# EAGLE design updateMate (EAGLE 9.7.0)
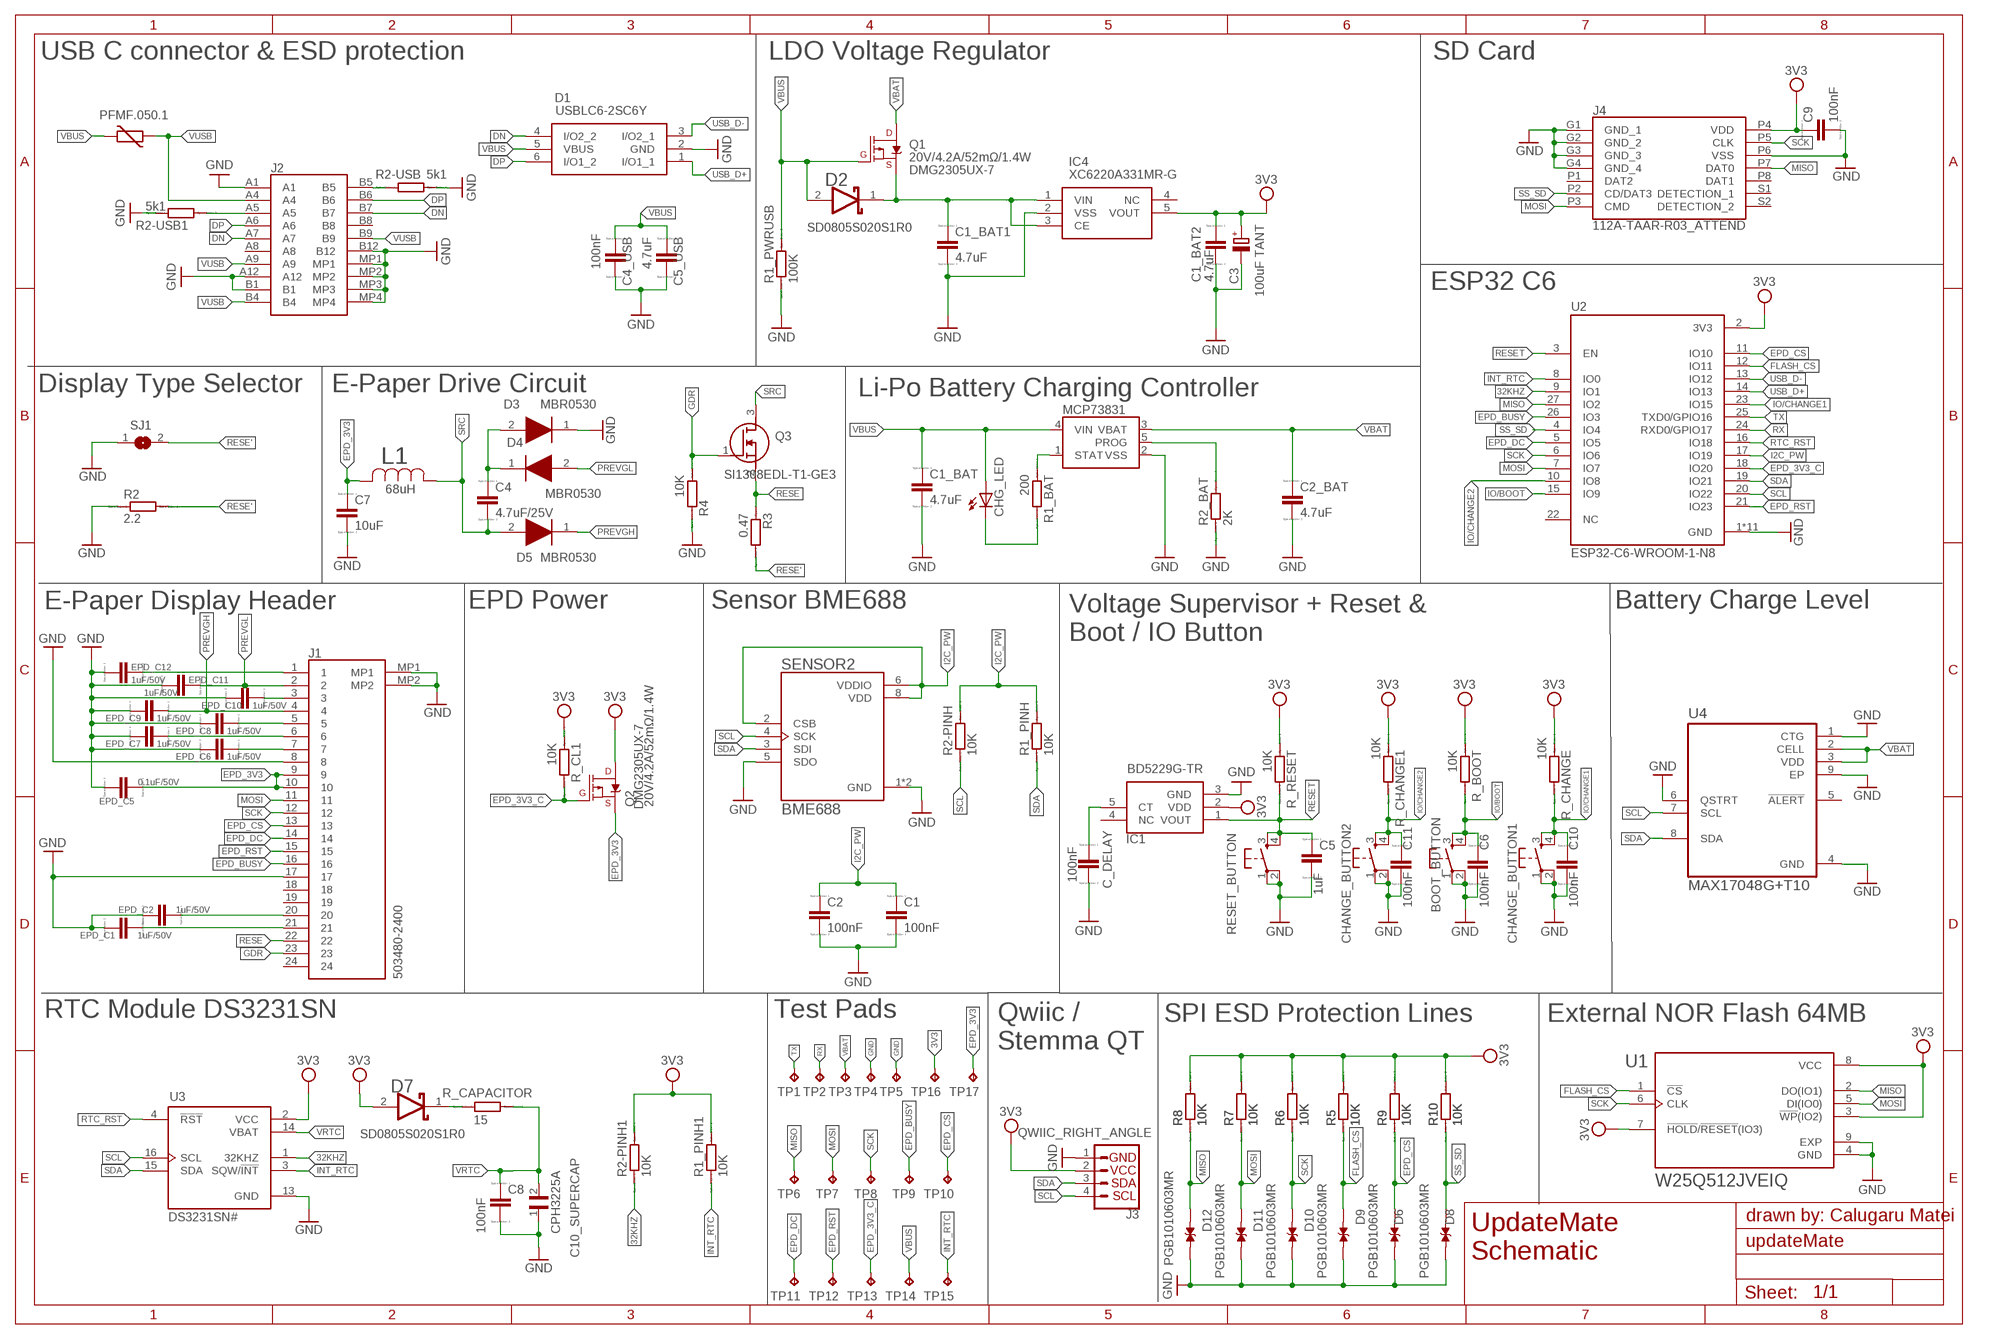
[diagram p0: schematic, sheet 1]

## Parts
BOOT_BUTTON  BUTTON_CUSYOMV1  [MYBUTTON]
C1  100nF  ESP32_WROVER_EAGLE-LTSPICE_CC0402  [ESP32_WROVER_EAGLE-LTSPICE_C0402]
C1_BAT  4.7uF  ESP32_WROVER_EAGLE-LTSPICE_CC0402  [ESP32_WROVER_EAGLE-LTSPICE_C0402]
C1_BAT1  4.7uF  ESP32_WROVER_EAGLE-LTSPICE_CC0402  [ESP32_WROVER_EAGLE-LTSPICE_C0402]
C1_BAT2  4.7uF  ESP32_WROVER_EAGLE-LTSPICE_CC0402  [ESP32_WROVER_EAGLE-LTSPICE_C0402]
C2  100nF  ESP32_WROVER_EAGLE-LTSPICE_CC0402  [ESP32_WROVER_EAGLE-LTSPICE_C0402]
C2_BAT  4.7uF  ESP32_WROVER_EAGLE-LTSPICE_CC0402  [ESP32_WROVER_EAGLE-LTSPICE_C0402]
C3  100uF TANT  RCL_CPOL-EUCT3528  [RCL_CT3528]
C4  4.7uF/25V  ESP32_WROVER_EAGLE-LTSPICE_CC0402  [ESP32_WROVER_EAGLE-LTSPICE_C0402]
C4_USB  100nF  ESP32_WROVER_EAGLE-LTSPICE_CC0402  [ESP32_WROVER_EAGLE-LTSPICE_C0402]
C5  1uF  ESP32_WROVER_EAGLE-LTSPICE_CC0402  [ESP32_WROVER_EAGLE-LTSPICE_C0402]
C5_USB  4.7uF  ESP32_WROVER_EAGLE-LTSPICE_CC0402  [ESP32_WROVER_EAGLE-LTSPICE_C0402]
C6  100nF  ESP32_WROVER_EAGLE-LTSPICE_CC0402  [ESP32_WROVER_EAGLE-LTSPICE_C0402]
C7  10uF  ESP32_WROVER_EAGLE-LTSPICE_CC0402  [ESP32_WROVER_EAGLE-LTSPICE_C0402]
C8  100nF  ESP32_WROVER_EAGLE-LTSPICE_CC0402  [ESP32_WROVER_EAGLE-LTSPICE_C0402]
C9  100nF  EAGLE-LTSPICE_CC0402  [EAGLE-LTSPICE_C0402]
C10  100nF  ESP32_WROVER_EAGLE-LTSPICE_CC0402  [ESP32_WROVER_EAGLE-LTSPICE_C0402]
C10_SUPERCAP  CPH3225A  [CAPCP3225X100N]
C11  100nF  ESP32_WROVER_EAGLE-LTSPICE_CC0402  [ESP32_WROVER_EAGLE-LTSPICE_C0402]
C_DELAY  100nF  ESP32_WROVER_EAGLE-LTSPICE_CC0402  [ESP32_WROVER_EAGLE-LTSPICE_C0402]
CHANGE_BUTTON1  BUTTON_CUSYOMV1  [MYBUTTON]
CHANGE_BUTTON2  BUTTON_CUSYOMV1  [MYBUTTON]
CHG_LED  ADAFRUIT_LEDCHIP-LED0603  [ADAFRUIT_CHIP-LED0603]
D1  USBLC6-2SC6Y  [SOT95P280X145-6N]
D2  ESP32_WROVER_AVX---SD0805S020S1R0_AVX_SD0805S020S1R0AVX_SD0805S020S1R0_0_0  ESP32_WROVER_AVX---SD0805S020S1R0_AVX_SD0805S020S1R0_0_0AVX_SD0805S020S1R0_0_0  [ESP32_WROVER_AVX---SD0805S020S1R0_AVX_SD0805S020S1R0_0]
D3  MBR0530  [SOD3716X135N]
D4  MBR0530  [SOD3716X135N]
D5  MBR0530  [SOD3716X135N]
D6  PGB1010603MR  [DIOC1608X36N]
D7  SD0805S020S1R0  ESP32_WROVER_AVX---SD0805S020S1R0_AVX_SD0805S020S1R0_0_0AVX_SD0805S020S1R0_0_0  [ESP32_WROVER_AVX---SD0805S020S1R0_AVX_SD0805S020S1R0_0]
D8  PGB1010603MR  [DIOC1608X36N]
D9  PGB1010603MR  [DIOC1608X36N]
D10  PGB1010603MR  [DIOC1608X36N]
D11  PGB1010603MR  [DIOC1608X36N]
D12  PGB1010603MR  [DIOC1608X36N]
EPD_C1  1uF/50V  ESP32_WROVER_EAGLE-LTSPICE_CC0402  [ESP32_WROVER_EAGLE-LTSPICE_C0402]
EPD_C2  1uF/50V  ESP32_WROVER_EAGLE-LTSPICE_CC0402  [ESP32_WROVER_EAGLE-LTSPICE_C0402]
EPD_C5  0.1uF/50V  ESP32_WROVER_EAGLE-LTSPICE_CC0402  [ESP32_WROVER_EAGLE-LTSPICE_C0402]
EPD_C6  1uF/50V  ESP32_WROVER_EAGLE-LTSPICE_CC0402  [ESP32_WROVER_EAGLE-LTSPICE_C0402]
EPD_C7  1uF/50V  ESP32_WROVER_EAGLE-LTSPICE_CC0402  [ESP32_WROVER_EAGLE-LTSPICE_C0402]
EPD_C8  1uF/50V  ESP32_WROVER_EAGLE-LTSPICE_CC0402  [ESP32_WROVER_EAGLE-LTSPICE_C0402]
EPD_C9  1uF/50V  ESP32_WROVER_EAGLE-LTSPICE_CC0402  [ESP32_WROVER_EAGLE-LTSPICE_C0402]
EPD_C10  1uF/50V  ESP32_WROVER_EAGLE-LTSPICE_CC0402  [ESP32_WROVER_EAGLE-LTSPICE_C0402]
EPD_C11  1uF/50V  ESP32_WROVER_EAGLE-LTSPICE_CC0402  [ESP32_WROVER_EAGLE-LTSPICE_C0402]
EPD_C12  1uF/50V  ESP32_WROVER_EAGLE-LTSPICE_CC0402  [ESP32_WROVER_EAGLE-LTSPICE_C0402]
IC1  BD5229G-TR  [SOT95P280X125-5N]
IC4  XC6220A331MR-G  [SOT95P280X120-5N]
J1  503480-2400  [5034802400]
J2  SAMACSYS_PARTS_USB4110-GF-A  [SAMACSYS_PARTS_USB4110GFA]
J3  QWIIC_RIGHT_ANGLE  QWIIC_CONNECTORJS-1MM  [JST04_1MM_RA]
J4  112A-TAAR-R03_ATTEND  [112ATAARR03ATTEND]
L1  68uH  744043680IND_4828-WE-TPC_WRE  [IND_4828-WE-TPC_WRE]
MCP73831  ESP32_WROVER_SPARKFUN-IC-POWER_MCP73831  [ESP32_WROVER_SPARKFUN-IC-POWER_SOT23-5]
PFMF.050.1  ESP32C6_VARISTORCN1812  [ESP32C6_VARISTOR_CT/CN1812]
Q1  20V/4.2A/52mΩ/1.4W  ESP32_WROVER_SPARKFUN-DISCRETESEMI_MOSFET_PCH-DMG2305UX-7  [ESP32_WROVER_SPARKFUN-DISCRETESEMI_SOT23-3]
Q2  20V/4.2A/52mΩ/1.4W  ESP32_WROVER_SPARKFUN-DISCRETESEMI_MOSFET_PCH-DMG2305UX-7  [ESP32_WROVER_SPARKFUN-DISCRETESEMI_SOT23-3]
Q3  SI1308EDL-T1-GE3  [SOT65P210X110-3N]
R1_BAT  200  ESP32_WROVER_EAGLE-LTSPICE_RR0402  [ESP32_WROVER_EAGLE-LTSPICE_R0402]
R1_PINH  10K  ESP32_WROVER_EAGLE-LTSPICE_RR0402  [ESP32_WROVER_EAGLE-LTSPICE_R0402]
R1_PINH1  10K  ESP32_WROVER_EAGLE-LTSPICE_RR0402  [ESP32_WROVER_EAGLE-LTSPICE_R0402]
R1_PWRUSB  100K  ESP32_WROVER_EAGLE-LTSPICE_RR0402  [ESP32_WROVER_EAGLE-LTSPICE_R0402]
R2  2.2  ESP32_WROVER_EAGLE-LTSPICE_RR0402  [ESP32_WROVER_EAGLE-LTSPICE_R0402]
R2-PINH  10K  ESP32_WROVER_EAGLE-LTSPICE_RR0402  [ESP32_WROVER_EAGLE-LTSPICE_R0402]
R2-PINH1  10K  ESP32_WROVER_EAGLE-LTSPICE_RR0402  [ESP32_WROVER_EAGLE-LTSPICE_R0402]
R2-USB  5k1  ESP32_WROVER_EAGLE-LTSPICE_RR0402  [ESP32_WROVER_EAGLE-LTSPICE_R0402]
R2-USB1  5k1  ESP32_WROVER_EAGLE-LTSPICE_RR0402  [ESP32_WROVER_EAGLE-LTSPICE_R0402]
R2_BAT  2K  ESP32_WROVER_EAGLE-LTSPICE_RR0402  [ESP32_WROVER_EAGLE-LTSPICE_R0402]
R3  0.47  ESP32_WROVER_EAGLE-LTSPICE_RR0402  [ESP32_WROVER_EAGLE-LTSPICE_R0402]
R4  10K  ESP32_WROVER_EAGLE-LTSPICE_RR0402  [ESP32_WROVER_EAGLE-LTSPICE_R0402]
R5  10K  ESP32_WROVER_EAGLE-LTSPICE_RR0402  [ESP32_WROVER_EAGLE-LTSPICE_R0402]
R6  10K  ESP32_WROVER_EAGLE-LTSPICE_RR0402  [ESP32_WROVER_EAGLE-LTSPICE_R0402]
R7  10K  ESP32_WROVER_EAGLE-LTSPICE_RR0402  [ESP32_WROVER_EAGLE-LTSPICE_R0402]
R8  10K  ESP32_WROVER_EAGLE-LTSPICE_RR0402  [ESP32_WROVER_EAGLE-LTSPICE_R0402]
R9  10K  ESP32_WROVER_EAGLE-LTSPICE_RR0402  [ESP32_WROVER_EAGLE-LTSPICE_R0402]
R10  10K  ESP32_WROVER_EAGLE-LTSPICE_RR0402  [ESP32_WROVER_EAGLE-LTSPICE_R0402]
R_BOOT  10K  ESP32_WROVER_EAGLE-LTSPICE_RR0402  [ESP32_WROVER_EAGLE-LTSPICE_R0402]
R_CAPACITOR  15  ESP32_WROVER_EAGLE-LTSPICE_RR0402  [ESP32_WROVER_EAGLE-LTSPICE_R0402]
R_CHANGE  10K  ESP32_WROVER_EAGLE-LTSPICE_RR0402  [ESP32_WROVER_EAGLE-LTSPICE_R0402]
R_CHANGE1  10K  ESP32_WROVER_EAGLE-LTSPICE_RR0402  [ESP32_WROVER_EAGLE-LTSPICE_R0402]
R_CL1  10K  ESP32_WROVER_EAGLE-LTSPICE_RR0402  [ESP32_WROVER_EAGLE-LTSPICE_R0402]
R_RESET  10K  ESP32_WROVER_EAGLE-LTSPICE_RR0402  [ESP32_WROVER_EAGLE-LTSPICE_R0402]
RESET_BUTTON  BUTTON_CUSYOMV1  [MYBUTTON]
SENSOR2  BME688  ESP32_WROVER_BME680_BME680  [ESP32_WROVER_BME680_PSON80P300X300X100-8N]
SJ1  SJ  [SJ]
TP1  TPTP20R  [TP20R]
TP2  TPTP20R  [TP20R]
TP3  TPTP20R  [TP20R]
TP4  TPTP20R  [TP20R]
TP5  TPTP20R  [TP20R]
TP6  TPTP20R  [TP20R]
TP7  TPTP20R  [TP20R]
TP8  TPTP20R  [TP20R]
TP9  TPTP20R  [TP20R]
TP10  TPTP20R  [TP20R]
TP11  TPTP20R  [TP20R]
TP12  TPTP20R  [TP20R]
TP13  TPTP20R  [TP20R]
TP14  TPTP20R  [TP20R]
TP15  TPTP20R  [TP20R]
TP16  TPTP20R  [TP20R]
TP17  TPTP20R  [TP20R]
U1  W25Q512JVEIQ  [SON127P600X800X80-9N]
U2  ESP32-C6-WROOM-1-N8  [XCVR_ESP32-C6-WROOM-1-N8]
U3  DS3231SN#  [SOIC127P1032X265-16N]
U4  MAX17048G+T10  [SON50P200X200X80-9N]

## Nets
3V3 [HIGH_CURRENT]: C1_BAT2.1 C3.+ C9.1 D7.2(ANODE) IC1.2(VDD) IC4.5(VOUT) J3.2 J4.P4(VDD) Q2.3(D) R1_PINH1.2 R2-PINH1.2 R5.2 R6.2 R7.2 R8.2 R9.2 R10.2 R_BOOT.1 R_CHANGE1.1 R_CHANGE.1 R_CL1.1 R_RESET.1 TP16.TP U1.3(!WP!(IO2)) U1.7(!HOLD!/!RESET!(IO3)) U1.8(VCC) U2.2(3V3) U3.2(VCC)
32KHZ: R2-PINH1.1 U2.9(IO1) U3.1(32KHZ)
DN: D1.4(I/O2_2) J2.A7 J2.B7
DP: D1.6(I/O1_2) J2.A6 J2.B6
EPD_3V3: C7.1 EPD_C5.1 J1.9 J1.10 L1.2 Q2.2(S) TP17.TP
EPD_3V3_C [HIGH_CURRENT]: Q2.1(G) R_CL1.2 TP13.TP U2.18(IO20)
EPD_BUSY: J1.16 TP9.TP U2.26(IO3)
EPD_CS: D6.1 J1.13 R9.1 TP10.TP U2.11(IO10)
EPD_DC: J1.14 TP11.TP U2.5(IO5)
EPD_RST: J1.15 TP12.TP U2.21(IO23)
FLASH_CS: D9.1 R5.1 U1.1(!CS) U2.12(IO11)
GDR: J1.23 Q3.1(G) R4.1
GND: BOOT_BUTTON.1 BOOT_BUTTON.2 C1.2 C1_BAT1.2 C1_BAT2.2 C1_BAT.2 C2.2 C2_BAT.2 C3.- C4_USB.2 C5.2 C5_USB.2 C6.2 C7.2 C8.2 C9.2 C10.2 C10_SUPERCAP.1 C11.2 C_DELAY.2 CHANGE_BUTTON1.1 CHANGE_BUTTON1.2 CHANGE_BUTTON2.1 CHANGE_BUTTON2.2 D1.2(GND) D3.1(K) D6.2 D8.2 D9.2 D10.2 D11.2 D12.2 EPD_C1.2 EPD_C2.2 EPD_C5.2 EPD_C6.2 EPD_C7.2 EPD_C8.2 EPD_C9.2 EPD_C10.2 EPD_C11.2 EPD_C12.2 IC1.3(GND) IC4.2(VSS) J1.8 J1.17 J1.MP1 J1.MP2 J2.A1 J2.A12 J2.B1 J2.B12 J2.MP1 J2.MP2 J2.MP3 J2.MP4 J3.1 J4.G1(GND_1) J4.G2(GND_2) J4.G3(GND_3) J4.G4(GND_4) J4.P6(VSS) MCP73831.2(VSS) R1_PWRUSB.1 R2-USB1.1 R2-USB.2 R2.1 R2_BAT.1 R4.2 RESET_BUTTON.1 RESET_BUTTON.2 SENSOR2.1(GND) SENSOR2.5(SDO) SENSOR2.7(GND) SJ1.1 TP4.TP TP5.TP U1.4(GND) U1.9(EXP) U2.1(GND) U2.28(GND) U2.29_1(GND) U2.29_2(GND) U2.29_3(GND) U2.29_4(GND) U2.29_5(GND) U2.29_6(GND) U2.29_7(GND) U2.29_8(GND) U2.29_9(GND) U3.13(GND) U4.1(CTG) U4.4(GND) U4.6(QSTRT) U4.9(EP)
I2C_PW: C1.1 C2.1 R1_PINH.2 R2-PINH.2 SENSOR2.2(CSB) SENSOR2.6(VDDIO) SENSOR2.8(VDD) U2.17(IO19)
INT_RTC: R1_PINH1.1 TP15.TP U2.8(IO0) U3.3(SQW/!INT)
IO/BOOT: BOOT_BUTTON.3 BOOT_BUTTON.4 C6.1 R_BOOT.2 U2.15(IO9)
IO/CHANGE1: C10.1 CHANGE_BUTTON1.3 CHANGE_BUTTON1.4 R_CHANGE.2 U2.23(IO15)
IO/CHANGE2: C11.1 CHANGE_BUTTON2.3 CHANGE_BUTTON2.4 R_CHANGE1.2 U2.10(IO8)
MISO: D12.1 J4.P7(DAT0) R8.1 TP6.TP U1.2(DO(IO1)) U2.27(IO2)
MOSI: D11.1 J1.11 J4.P3(CMD) R7.1 TP7.TP U1.5(DI(IO0)) U2.7(IO7)
N$1: J2.B5 R2-USB.1
N$2: C_DELAY.1 IC1.5(CT)
N$3: C1_BAT1.1 D2.1(CATHODE) IC4.1(VIN) IC4.3(CE) Q1.2(S)
N$4: J2.A5 R2-USB1.2
N$7: D7.1(CATHODE) R_CAPACITOR.2
N$8: EPD_C1.1 J1.21
N$9: EPD_C2.1 J1.20
N$10: C4.1 D3.2(A) D4.1(K)
N$13: MCP73831.5(PROG) R2_BAT.2
N$14: MCP73831.1(STAT) R1_BAT.1
N$15: CHG_LED.C R1_BAT.2
N$31: EPD_C6.1 J1.7
N$33: EPD_C7.1 J1.6
N$34: EPD_C8.1 J1.5
N$36: EPD_C10.1 J1.3
N$37: EPD_C12.1 J1.1
PREVGH: D5.1(K) EPD_C9.1 J1.4
PREVGL: D4.2(A) EPD_C11.1 J1.2
RESE: J1.22 Q3.2(S) R3.1
RESE': R2.2 R3.2 SJ1.2
RESET: C5.1 IC1.1(VOUT) R_RESET.2 RESET_BUTTON.3 RESET_BUTTON.4 U2.3(EN)
RTC_RST: U2.16(IO18) U3.4(!RST)
RX: TP2.TP U2.24(RXD0/GPIO17)
SCK: D10.1 J1.12 J4.P5(CLK) R6.1 TP8.TP U1.6(CLK) U2.6(IO6)
SCL: J3.4 R2-PINH.1 SENSOR2.4(SCK) U2.20(IO22) U3.16(SCL) U4.7(SCL)
SDA: J3.3 R1_PINH.1 SENSOR2.3(SDI) U2.19(IO21) U3.15(SDA) U4.8(SDA)
SRC: C4.2 D5.2(A) L1.1 Q3.3(D)
SS_SD: D8.1 J4.P2(CD/DAT3) R10.1 U2.4(IO4)
TX: TP1.TP U2.25(TXD0/GPIO16)
USB_D+: D1.1(I/O1_1) U2.14(IO13)
USB_D-: D1.3(I/O2_1) U2.13(IO12)
VBAT [HIGH_CURRENT]: C2_BAT.1 MCP73831.3(VBAT) Q1.3(D) TP3.TP U4.2(CELL) U4.3(VDD)
VBUS [HIGH_CURRENT]: C1_BAT.1 C4_USB.1 C5_USB.1 CHG_LED.A D1.5(VBUS) D2.2(ANODE) MCP73831.4(VIN) PFMF.050.1.1 Q1.1(G) R1_PWRUSB.2 TP14.TP
VRTC: C8.1 C10_SUPERCAP.2 R_CAPACITOR.1 U3.14(VBAT)
VUSB [HIGH_CURRENT]: J2.A4 J2.A9 J2.B4 J2.B9 PFMF.050.1.2
Unconnected: IC1.4(NC) IC4.4(NC) J1.18 J1.19 J1.24 J2.A8 J2.B8 J4.P1(DAT2) J4.P8(DAT1) J4.S1(DETECTION_1) J4.S2(DETECTION_2) U2.22(NC) U4.5(!ALERT)

## Notes on the sheet
- USB C connector & ESD protection | LDO Voltage Regulator | SD Card
- DMG2305UX-7
- SD0805S020S1R0
- ESP32 C6
- Display Type Selector | E-Paper Drive Circuit | Li-Po Battery Charging Controller
- 68uH
- E-Paper Display Header | EPD Power | Sensor BME688 | Battery Charge Level
- Voltage Supervisor + Reset & 
  Boot / IO Button
- DMG2305UX-7
- RTC Module DS3231SN | Test Pads | SPI ESD Protection Lines | External NOR Flash 64MB
- Qwiic /
  Stemma QT
- SD0805S020S1R0
- drawn by: Calugaru Matei
- UpdateMate 
  Schematic

## Library data of the parts
BOOT_BUTTON CHANGE_BUTTON1 CHANGE_BUTTON2 RESET_BUTTON = ButtonLibrary:BUTTON_CUSYOMV1
C1 C1_BAT C1_BAT1 C1_BAT2 C2 C2_BAT C4 C4_USB C5 C5_USB C6-C8 C10 C11 C_DELAY EPD_C1 EPD_C2 EPD_C5-EPD_C12 = ESP32_C6_Library:ESP32_WROVER_EAGLE-LTSPICE_C: CAPACITOR, European symbol; SPICEMODEL: NONE; SPICEPREFIX: C
C3 = ESP32_C6_Library:RCL_CPOL-EU: POLARIZED CAPACITOR, European symbol; SPICEPREFIX: C
C9 = Hector_Watch:EAGLE-LTSPICE_C: CAPACITOR, European symbol; SPICEMODEL: NONE; SPICEPREFIX: C
C10_SUPERCAP = ESP32_C6_Library:CPH3225A: Cap 0.011F 3.3V 1210 Flat Check availability <https://pricing.snapeda.com/parts/CPH3225A/Seiko%20Instruments/view-part?ref=eda>; AVAILABILITY: Not in stock; CHECK_PRICES: https://www.snapeda.com/parts/CPH3225A/Seiko+Instruments/view-part/?ref=eda; DESCRIPTION: 11 mF (EDLC) Supercapacitor 3.3 V 1210 (3225 Metric) - -; MF: Seiko Instruments; MP: CPH3225A; PACKAGE: 1210 Seiko; PRICE: None; PURCHASE-URL: https://www.snapeda.com/api/url_track_click_mouser/?unipart_id=562593&manufacturer=Seiko Instruments&part_name=CPH3225A&search_term=None; SNAPEDA_LINK: https://www.snapeda.com/parts/CPH3225A/Seiko+Instruments/view-part/?ref=snap
CHG_LED = ESP32_C6_Library:ADAFRUIT_LED: LED OSRAM: - CHIPLED LG R971, LG N971, LY N971, LG Q971, LY Q971, LO R971, LY R971 LH N974, LH R974 LS Q976, LO Q976, LY Q976 LO Q996 - Hyper CHIPLED LW Q18S LB Q993, LB Q99A, LB R99A - SideLED LS A670, LO A670, LY A670, LG A670, LP A670 LB A673, LV A673, LT A673, LW A673 LH A674 LY A675 LS A676, LA A676, LO A676, LY A676, LW A676 LS A679, LY A679, LG A679 - Hyper Micro SIDELED® LS Y876, LA Y876, LO Y876, LY Y876 LT Y87S - SmartLED LW L88C, LW L88S LB L89C, LB L89S, LG L890 LS L89K, LO L89K, LY L89K LS L896, LA L896, LO L896, LY L896 - TOPLED LS T670, LO T670, LY T670, LG T670, LP T670 LSG T670, LSP T670, LSY T670, LOP T670, LYG T670 LG T671, LOG T671, LSG T671 LB T673, LV T673, LT T673, LW T673 LH T674 LS T676, LA T676, LO T676, LY T676, LB T676, LH T676, LSB T676, LW T676 LB T67C, LV T67C, LT T67C, LS T67K, LO T67K, LY T67K, LW E67C LS E67B, LA E67B, LO E67B, LY E67B, LB E67C, LV E67C, LT E67C LW T67C LS T679, LY T679, LG T679 LS T770, LO T770, LY T770, LG T770, LP T770 LB T773, LV T773, LT T773, LW T773 LH T774 LS E675, LA E675, LY E675, LS T675 LS T776, LA T776, LO T776, LY T776, LB T776 LHGB T686 LT T68C, LB T68C - Hyper Mini TOPLED® LB M676 - Mini TOPLED Santana® LG M470 LS M47K, LO M47K, LY M47K Source: http://www.osram.convergy.de/
D1 = ESP32_C6_Library:USBLC6-2SC6Y: Low Cap. ESD Protection Auto SOT-23-6 STMicroelectronics USBLC6-2SC6Y, Dual Uni-Directional TVS Diode Array, 6-Pin SOT-23 Source: Datasheet <https://componentsearchengine.com/Datasheets/1/USBLC6-2SC6Y.pdf> Check availability <https://pricing.snapeda.com/parts/USBLC6-2SC6Y/STMicroelectronics/view-part?ref=eda>; AVAILABILITY: In Stock; CHECK_PRICES: https://www.snapeda.com/parts/USBLC6-2SC6Y/STMicroelectronics/view-part/?ref=eda; DESCRIPTION: 17V Clamp 5A (8/20µs) Ipp Tvs Diode Surface Mount SOT-23-6; MF: STMicroelectronics; MP: USBLC6-2SC6Y; PACKAGE: SOT-23-6 STMicroelectronics; PRICE: None; SNAPEDA_LINK: https://www.snapeda.com/parts/USBLC6-2SC6Y/STMicroelectronics/view-part/?ref=snap
D2 D7 = ESP32_C6_Library:ESP32_WROVER_AVX---SD0805S020S1R0_AVX_SD0805S020S1R0_0_0: Schottky Barrier Rectifier Diode; CENTROID_NOT_SPECIFIED: No; DATASHEET: http://datasheets.avx.com/schottky.pdf; DIGIKEY_DESCRIPTION: DIODE SCHOTTKY 20V 1A 0805; DIGIKEY_PART_NUMBER: 478-7800-1-ND; LEAD_FREE: yes; MF: AVX; MOUSER_PART_NUMBER: 581-SD0805S020S1R0; PACKAGE: 0805 (2012 metric); PREFIX: D; ROHS: yes; TEMPERATURE_RANGE_HIGH: +125°C; TEMPERATURE_RANGE_LOW: -55°C
D3-D5 = ESP32_C6_Library:MBR0530: ON SEMICONDUCTOR - MBR0530 - DIODE, SCHOTTKY, 0.5A, 30V, SOD-123 Source: Datasheet <http://www.onsemi.com/pub/Collateral/MBR0530T1-D.PDF> Check availability <https://pricing.snapeda.com/parts/MBR0530/ON%20Semiconductor/view-part?ref=eda>; AVAILABILITY: In Stock; CHECK_PRICES: https://www.snapeda.com/parts/MBR0530/Onsemi/view-part/?ref=eda; DESCRIPTION: Diode Schottky 30 V 500mA Surface Mount SOD-123; MF: ON Semiconductor; MP: MBR0530; PACKAGE: SOD-123-2 ON Semiconductor; PRICE: None; PURCHASE-URL: https://www.snapeda.com/api/url_track_click_mouser/?unipart_id=179458&manufacturer=ON Semiconductor&part_name=MBR0530&search_term=None; SNAPEDA_LINK: https://www.snapeda.com/parts/MBR0530/Onsemi/view-part/?ref=snap
D6 D8-D12 = ESP32_C6_Library:PGB1010603MR: Check availability <https://pricing.snapeda.com/parts/PGB1010603MR/Littelfuse%20Inc./view-part?ref=eda>; AVAILABILITY: In Stock; CHECK_PRICES: https://www.snapeda.com/parts/PGB1010603MR/Littelfuse/view-part/?ref=eda; DESCRIPTION: 150V (Typ) Clamp - Ipp Tvs Diode Surface Mount 0603 (1608 Metric); MF: Littelfuse Inc.; MP: PGB1010603MR; PACKAGE: 0603 Littelfuse Inc.; PRICE: None; PURCHASE-URL: https://www.snapeda.com/api/url_track_click_mouser/?unipart_id=5659453&manufacturer=Littelfuse Inc.&part_name=PGB1010603MR&search_term=None; SNAPEDA_LINK: https://www.snapeda.com/parts/PGB1010603MR/Littelfuse/view-part/?ref=snap
IC1 = ESP32_C6_Library:BD5229G-TR: Voltage Detector with Adjustable Delay Time: CMOS processes are utilized to develop high precision, low current consumption CMOS reset ICs that allow arbitrary setting of the delay time. The extensive lineup includes both Nch Open Drain and CMOS output types in a wide range of detection voltages (from 2.3V to 6.0V, in 0.1V steps), enabling selection of the ideal solution based on customer requirements. In addition, the entire series is of course both lead-free and RoHS-compliant. Source: Datasheet <https://datasheet.datasheetarchive.com/originals/distributors/Datasheets_SAMA/f2b9741ef86007909f138d561a359946.pdf>; DESCRIPTION: Voltage Detector with Adjustable Delay Time: CMOS processes are utilized to develop high precision, low current consumption CMOS reset ICs that allow arbitrary setting of the delay time. The extensive lineup includes both Nch Open Drain and CMOS output types in a wide range of detection voltages (from 2.3V to 6.0V, in 0.1V steps), enabling selection of the ideal solution based on customer requirements. In addition, the entire series is of course both lead-free and RoHS-compliant.; HEIGHT: 1.25mm; MANUFACTURER_NAME: ROHM Semiconductor; MANUFACTURER_PART_NUMBER: BD5229G-TR; MOUSER_PART_NUMBER: 755-BD5229G-TR; MOUSER_PRICE-STOCK: https://www.mouser.co.uk/ProductDetail/ROHM-Semiconductor/BD5229G-TR?qs=4kLU8WoGk0vvnhrrYwdszw%3D%3D
IC4 = ESP32_C6_Library:XC6220A331MR-G: LDO Voltage Regulators Source: Datasheet <https://www.torexsemi.com/file/xc6220/XC6220.pdf>; DESCRIPTION: LDO Voltage Regulators; HEIGHT: 1.2mm; MANUFACTURER_NAME: Torex; MANUFACTURER_PART_NUMBER: XC6220A331MR-G; MOUSER_PART_NUMBER: 865-XC6220A331MR-G; MOUSER_PRICE-STOCK: https://www.mouser.co.uk/ProductDetail/Torex-Semiconductor/XC6220A331MR-G?qs=AsjdqWjXhJ8ZSWznL1J0gg%3D%3D
J1 = 503480-2400:503480-2400: FFC & FPC Connectors 0.5mm FPC RA SMT Dual Contact 24Ckt Source: Datasheet <https://componentsearchengine.com/Datasheets/1/503480-2400.pdf>; DESCRIPTION: FFC & FPC Connectors 0.5mm FPC RA SMT Dual Contact 24Ckt; HEIGHT: 1.87mm; MANUFACTURER_NAME: Molex; MANUFACTURER_PART_NUMBER: 503480-2400; MOUSER_PART_NUMBER: 538-503480-2400; MOUSER_PRICE-STOCK: https://www.mouser.co.uk/ProductDetail/Molex/503480-2400?qs=OAhjpuo3Vu7efIoxFh9AOw%3D%3D
J2 = ESP32_C6_Library:SAMACSYS_PARTS_USB4110-GF-A: CONN USB 2.0 TYPE-C R/A SMT Source: Datasheet <https://gct.co/files/drawings/usb4110.pdf>; DESCRIPTION: CONN USB 2.0 TYPE-C R/A SMT; HEIGHT: 3.26mm; MANUFACTURER_NAME: GCT (GLOBAL CONNECTOR TECHNOLOGY); MANUFACTURER_PART_NUMBER: USB4110-GF-A; MOUSER_PART_NUMBER: 640-USB4110-GF-A; MOUSER_PRICE-STOCK: https://www.mouser.co.uk/ProductDetail/GCT/USB4110-GF-A?qs=KUoIvG%2F9IlYiZvIXQjyJeA%3D%3D
J3 = ESP32_C6_Library:QWIIC_CONNECTOR: SparkFun I2C Standard Qwiic Connector An SMD 1mm pitch JST connector makes it easy and quick (get it? Qwiic?) to connect I2C devices to each other. The Qwiic system <http://www.sparkfun.com/qwiic> enables fast and solderless connection between popular platforms and various sensors and actuators. We carry 200mm <https://www.sparkfun.com/products/14204>, 100mm <https://www.sparkfun.com/products/14205>, 50mm <https://www.sparkfun.com/products/14206>, and breadboard friendly <https://www.sparkfun.com/products/14207> Qwiic cables. We also offer 10 pcs strips <https://www.sparkfun.com/products/14323> the SMD connectors.; PROD_ID: CONN-13694
J4 = Hector_Watch:112A-TAAR-R03_ATTEND: Micro SD Card Socket, Push-Push Type, Top Mount, SMT, H=1.83mm, 10u Source: Datasheet <https://www.attend.com.tw/data/download/file/112A-TAAR-R03.pdf>; DESCRIPTION: Micro SD Card Socket, Push-Push Type, Top Mount, SMT, H=1.83mm, 10u; HEIGHT: 1.9mm; MANUFACTURER_NAME: ATTEND; MANUFACTURER_PART_NUMBER: 112A-TAAR-R03 ATTEND
L1 = ESP32_C6_Library:744043680; COPYRIGHT: Copyright (C) 2024 Ultra Librarian. All rights reserved.; MANUFACTURER_PART_NUMBER: 744043680; MFR_NAME: Wurth Electronics
MCP73831 = ESP32_C6_Library:ESP32_WROVER_SPARKFUN-IC-POWER_MCP73831: MCP73831T Li-Ion, Li-Pol Controller Miniature single cell, fully integrated Li-Ion, Li-polymer charge management controller Datasheet <http://ww1.microchip.com/downloads/en/DeviceDoc/20001984g.pdf> SparkFun Products: SparkFun ESP32 Thing <https://www.sparkfun.com/products/13907> SparkFun 9DoF Razor IMU M0 <https://www.sparkfun.com/products/14001>; PROD_ID: IC-09995
PFMF.050.1 = ESP32_C6_Library:ESP32C6_VARISTOR: VARISTOR
Q1 Q2 = ESP32_C6_Library:ESP32_WROVER_SPARKFUN-DISCRETESEMI_MOSFET_PCH: P-channel MOSFETs Voltage controlled devices that allow control of high current outputs. SparkFun Products: SparkFun ESP32 Thing <https://www.sparkfun.com/products/13907> SparkFun ESP8266 Thing <https://www.sparkfun.com/products/13231> SparkFun Pi Servo HAT V2 <https://www.sparkfun.com/products/15316> DMG2305UX-7 (20V/4.2A/SOT23-3); PROD_ID: TRAN-14388
Q3 = ESP32_C6_Library:SI1308EDL-T1-GE3: MOSFET N-Ch 30V 1.5A TrenchFET SC70 Vishay Si1308EDL-T1-GE3 N-channel MOSFET Transistor, 1.5 A, 30 V, 3-Pin SC-70 Source: Datasheet <https://componentsearchengine.com/Datasheets/1/SI1308EDL-T1-GE3.pdf> Check availability <https://pricing.snapeda.com/parts/SI1308EDL-T1-GE3/Vishay%20Siliconix/view-part?ref=eda>; AVAILABILITY: In Stock; CHECK_PRICES: https://www.snapeda.com/parts/SI1308EDL-T1-GE3/Vishay+Siliconix/view-part/?ref=eda; DESCRIPTION: Si1308EDL-T1-GE3 N-channel MOSFET Transistor, 1.5 A, 30 V, 3-Pin SC-70 | Siliconix / Vishay SI1308EDL-T1-GE3; MF: Vishay Siliconix; MP: SI1308EDL-T1-GE3; PACKAGE: SOT-323 Vishay Semiconductor; PRICE: None; PURCHASE-URL: https://www.snapeda.com/api/url_track_click_mouser/?unipart_id=274603&manufacturer=Vishay Siliconix&part_name=SI1308EDL-T1-GE3&search_term=None; SNAPEDA_LINK: https://www.snapeda.com/parts/SI1308EDL-T1-GE3/Vishay+Siliconix/view-part/?ref=snap
R1_BAT R1_PINH R1_PINH1 R1_PWRUSB R2 R2-PINH R2-PINH1 R2-USB R2-USB1 R2_BAT R3-R10 R_BOOT R_CAPACITOR R_CHANGE R_CHANGE1 R_CL1 R_RESET = ESP32_C6_Library:ESP32_WROVER_EAGLE-LTSPICE_R: RESISTOR, European symbol; SPICEMODEL: NONE; SPICEPREFIX: R
SENSOR2 = ESP32_C6_Library:ESP32_WROVER_BME680_BME680: Integrated Environmental Unit; AVAILABILITY: Unavailable; DESCRIPTION: Integrated Environmental Unit; MF: Bosch Sensortec; MP: BME680; PACKAGE: LGA-8 Bosch Tools; PRICE: None
SJ1 = Hector_Watch:SJ: SMD solder JUMPER
TP1-TP17 = Hector_Watch:TP: Test pad
U1 = ESP32_C6_Library:W25Q512JVEIQ: Check availability <https://pricing.snapeda.com/parts/W25Q512JVEIQ/Winbond%20Electronics/view-part?ref=eda>; AVAILABILITY: In Stock; CHECK_PRICES: https://www.snapeda.com/parts/W25Q512JVEIQ/Winbond+Electronics/view-part/?ref=eda; DESCRIPTION: FLASH - NOR Memory IC 512Mb (64M x 8) SPI - Quad I/O 133 MHz 8-WSON (8x6); MF: Winbond Electronics; MP: W25Q512JVEIQ; PACKAGE: Package; PRICE: None; SNAPEDA_LINK: https://www.snapeda.com/parts/W25Q512JVEIQ/Winbond+Electronics/view-part/?ref=snap
U2 = ESP32_C6_Sparrow:ESP32-C6-WROOM-1-N8: Check availability <https://pricing.snapeda.com/parts/ESP32-C6-WROOM-1-N8/Espressif%20Systems/view-part?ref=eda>; AVAILABILITY: In Stock; CHECK_PRICES: https://www.snapeda.com/parts/ESP32-C6-WROOM-1-N8/Espressif+Systems/view-part/?ref=eda; DESCRIPTION: Multiprotocol Modules ESP32-C6 module, Wi-Fi 6 in 2.4 GHz band, Bluetooth 5, Zigbee 3.0 and Thread. ESP34-WROOM Compatible - ENGINEERING SAMPLE; MF: Espressif Systems; MP: ESP32-C6-WROOM-1-N8; PACKAGE: None; PRICE: None; SNAPEDA_LINK: https://www.snapeda.com/parts/ESP32-C6-WROOM-1-N8/Espressif+Systems/view-part/?ref=snap
U3 = ESP32_C6_Library:DS3231SN#: Real Time Clock Serial 16-Pin SOIC W T/R Check availability <https://pricing.snapeda.com/parts/DS3231SN%23/Analog%20Devices/view-part?ref=eda>; AVAILABILITY: In Stock; CHECK_PRICES: https://www.snapeda.com/parts/DS3231SN%23/Analog+Devices/view-part/?ref=eda; DESCRIPTION: Extremely Accurate I²C-Integrated RTC/TCXO/Crystal; MF: Analog Devices; MP: DS3231SN#; PACKAGE: SOIC-16 Maxim; PRICE: None; PURCHASE-URL: https://www.snapeda.com/api/url_track_click_mouser/?unipart_id=99048&manufacturer=Analog Devices&part_name=DS3231SN#&search_term=None; SNAPEDA_LINK: https://www.snapeda.com/parts/DS3231SN%23/Analog+Devices/view-part/?ref=snap
U4 = ESP32_C6_Library:MAX17048G+T10: Check availability <https://pricing.snapeda.com/parts/MAX17048G%2BT10/Analog%20Devices/view-part?ref=eda>; AVAILABILITY: In Stock; CHECK_PRICES: https://www.snapeda.com/parts/MAX17048G+T10/Analog+Devices/view-part/?ref=eda; DESCRIPTION: 3µA 1-Cell/2-Cell Fuel Gauge with ModelGauge; MF: Analog Devices; MP: MAX17048G+T10; PACKAGE: TDFN-8 Maxim; PRICE: None; PURCHASE-URL: https://www.snapeda.com/api/url_track_click_mouser/?unipart_id=329239&manufacturer=Analog Devices&part_name=MAX17048G+T10&search_term=None; SNAPEDA_LINK: https://www.snapeda.com/parts/MAX17048G+T10/Analog+Devices/view-part/?ref=snap

## Board
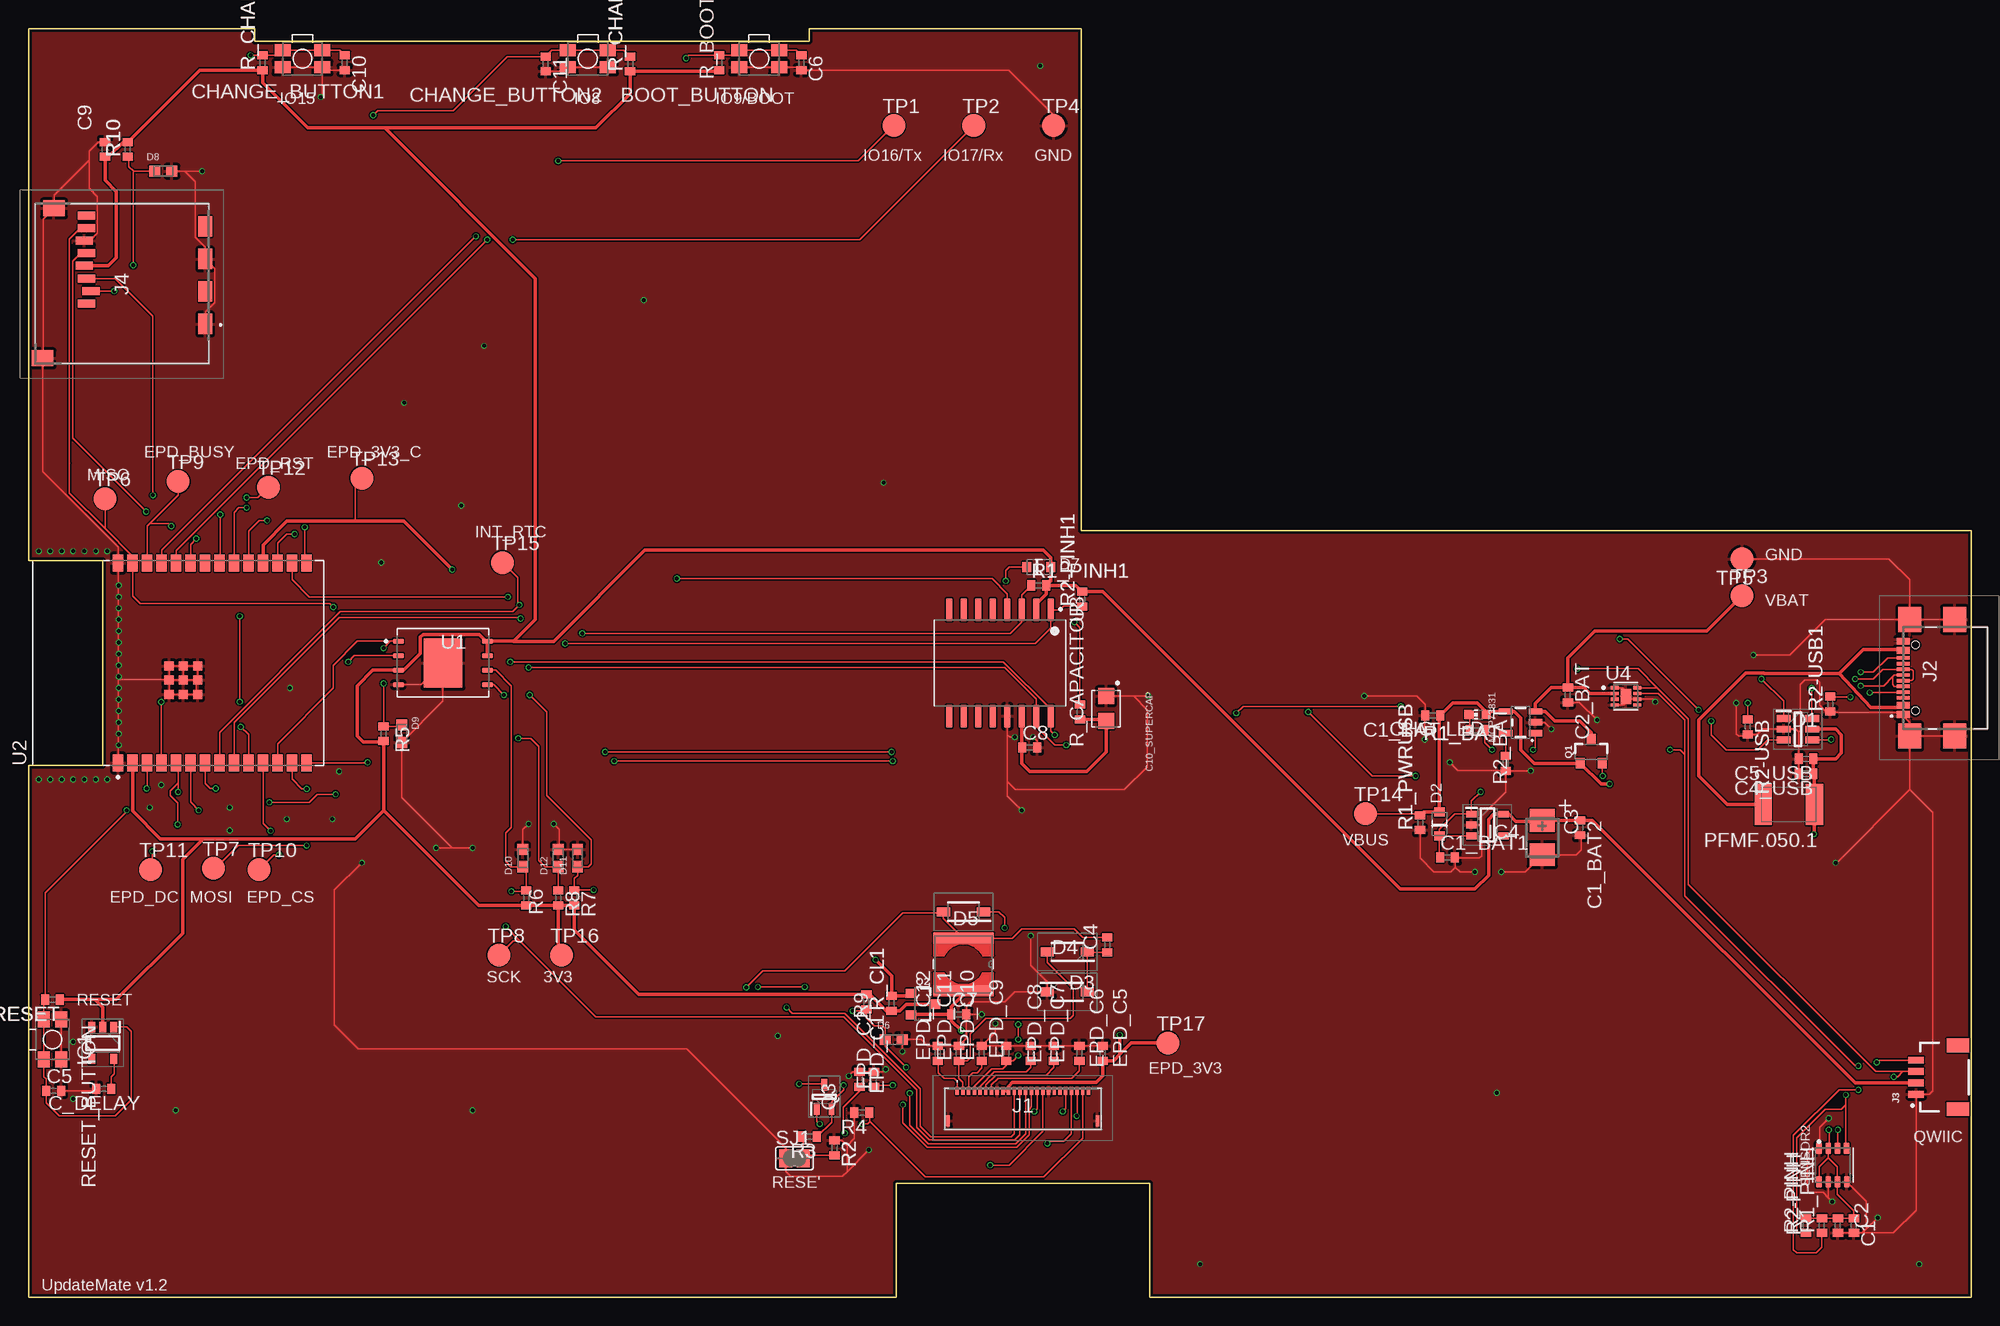
[diagram p1: board, top side]
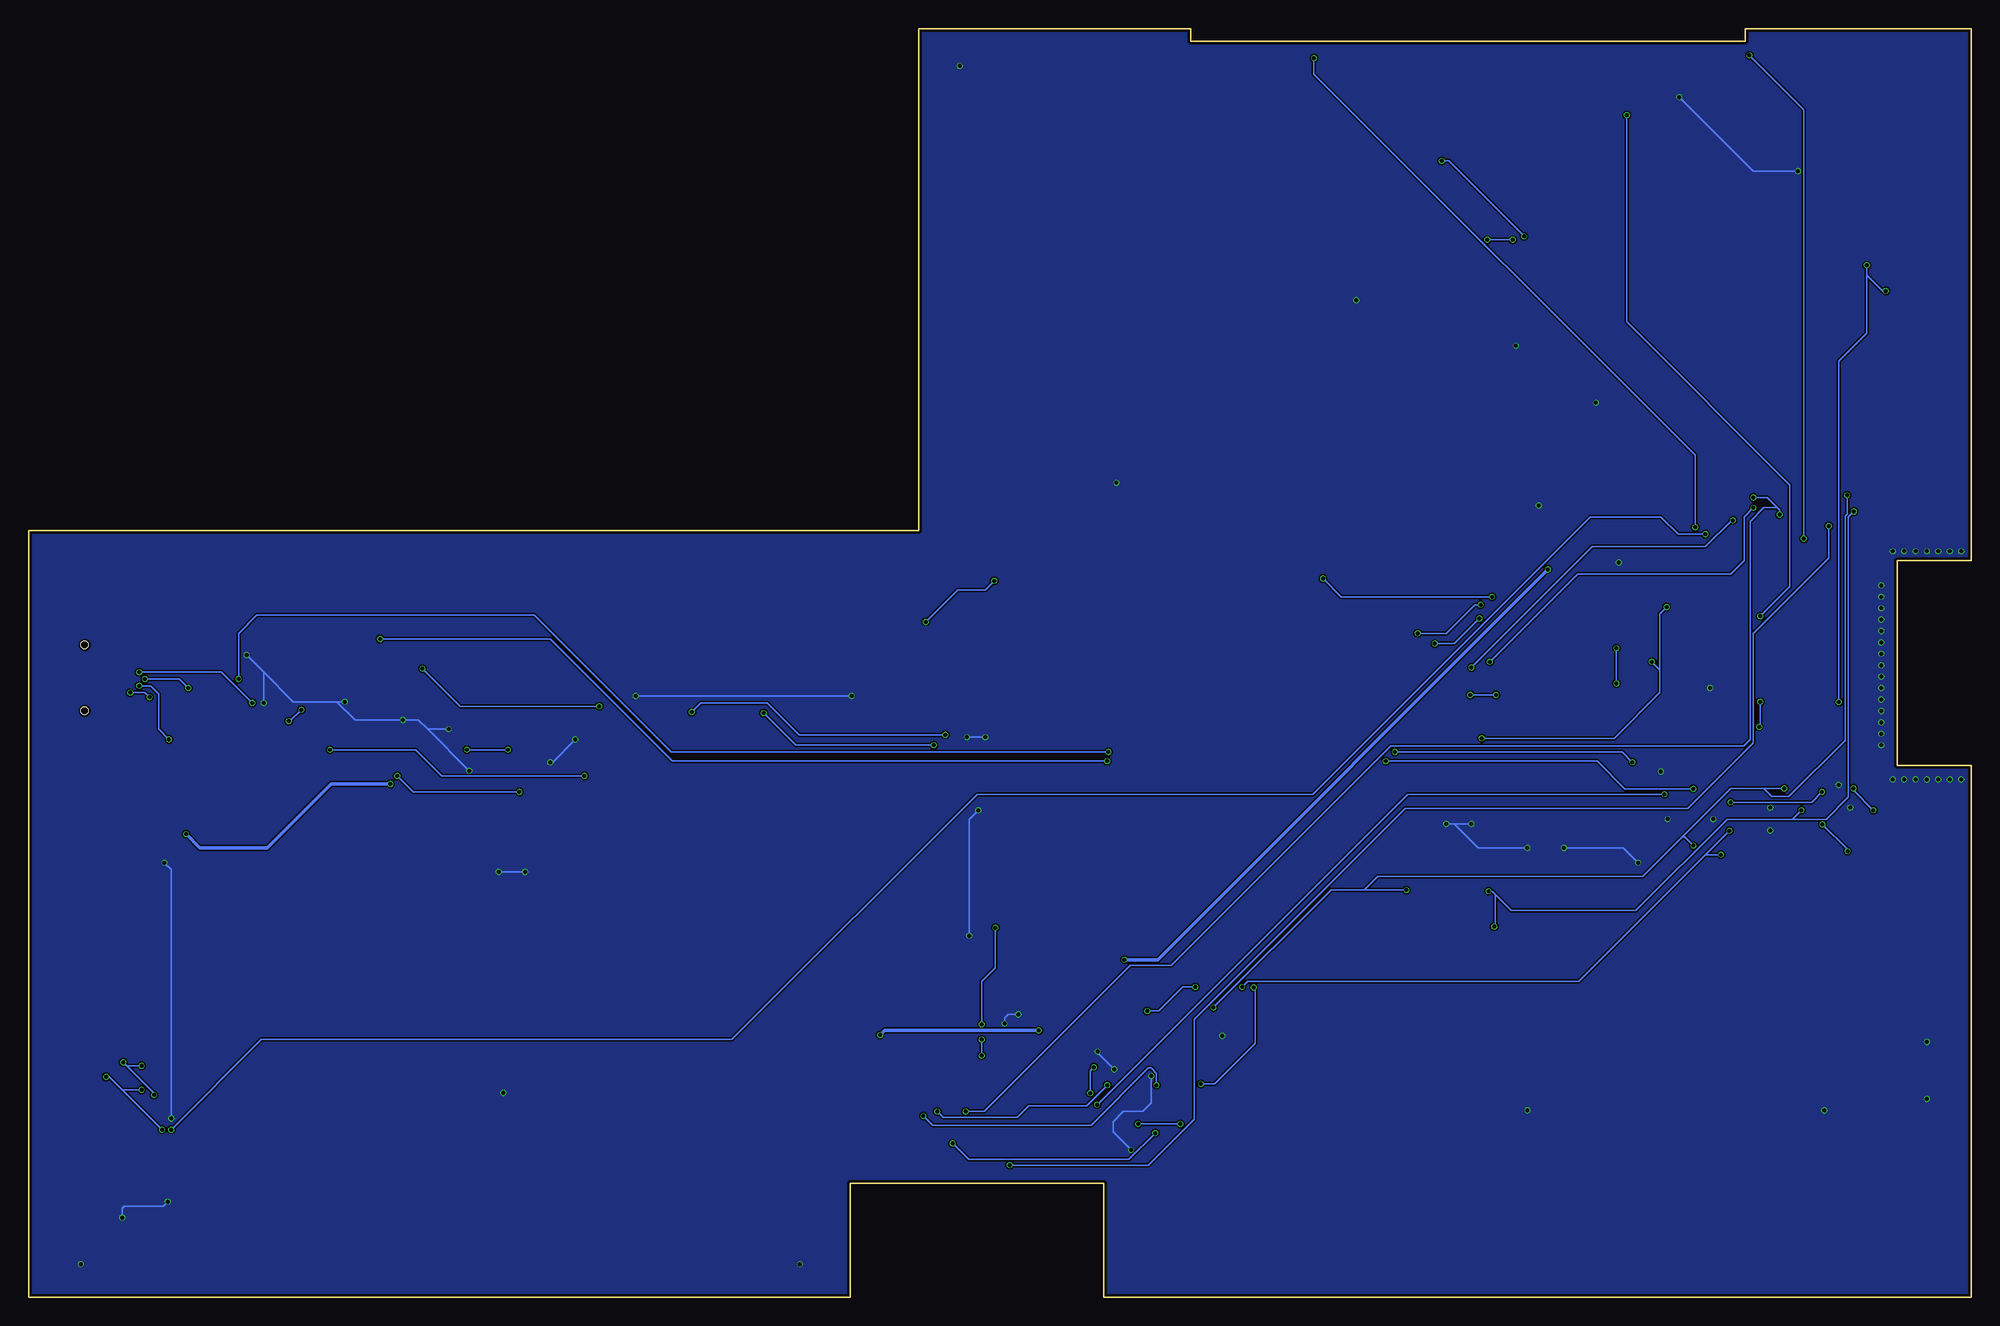
[diagram p2: board, bottom side, seen from below]

Size 170.2 x 111.2 mm. Coordinates in mm from the lower left corner, seen from the top.
Outline: 92.2,111.2 68.4,111.2 68.4,110.1 19.8,110.1 19.8,111.2 0,111.2 0,64.6 6.5,64.6 6.5,46.6 0,46.6 0,0 76,0 76,10 98.2,10 98.2,0 170.2,0 170.2,67.2 92.2,67.2 92.2,111.2
Copper layers (1*16): Top 0.035mm / dielectric 1.6mm / Bottom 0.035mm
Design rules "jlcpcb-2layers.dru *": minimum track width 5mil, minimum drill 0.3mm, track to track 5mil, track to pad 5mil, pad to pad 5mil, via to via 5mil, smd to smd 5mil, copper to edge 0.2mm, drill to drill 6mil, minimum pad ring 10mil, minimum via ring 3mil, stop-mask expansion 4mil, vias tented up to drill 1mm, thermal gap 10mil

### Footprints (pad centres in the part's own frame; a part is rotated, then mirrored left to right if it is on the bottom)
MYBUTTON = smd 1.4 x 1.05: 1 1.75,0.75; 2 -1.75,0.75; 3 -1.75,-0.75; 4 1.75,-0.75
ESP32_WROVER_EAGLE-LTSPICE_C0402 = smd 0.7 x 0.9: 1 -0.65,0; 2 0.65,0
RCL_CT3528 = smd 2 x 2.2: + -1.5,0; - 1.5,0
EAGLE-LTSPICE_C0402 = smd 0.7 x 0.9: 1 -0.65,0; 2 0.65,0
CAPCP3225X100N = smd 1.4 x 1.4: 1 -1.1,0; 2 1.1,0
ADAFRUIT_CHIP-LED0603 = smd 0.8 x 0.8: A 0,-0.75; C 0,0.75
SOT95P280X145-6N = smd 1.2 x 0.6: 1 -1.25,0.95; 2 -1.25,0; 3 -1.25,-0.95; 4 1.25,-0.95; 5 1.25,0; 6 1.25,0.95
ESP32_WROVER_AVX---SD0805S020S1R0_AVX_SD0805S020S1R0_0 = smd 0.8 x 0.9: 1 -1.05,0; 2 1.05,0
SOD3716X135N = smd 1.15 x 0.8: 1 -1.75,0; 2 1.75,0
DIOC1608X36N = smd 0.97 x 0.94: 1 -0.75,0; 2 0.75,0
SOT95P280X125-5N = smd 0.9 x 0.6: 1 -1.4,0.95; 2 -1.4,0; 3 -1.4,-0.95; 4 1.4,-0.95; 5 1.4,0.95
SOT95P280X120-5N = smd 0.9 x 0.6: 1 -1.4,0.95; 2 -1.4,0; 3 -1.4,-0.95; 4 1.4,-0.95; 5 1.4,0.95
5034802400 = smd 0.3 x 0.7: 1 -5.75,1.525; 2 -5.25,1.525; 3 -4.75,1.525; 4 -4.25,1.525; 5 -3.75,1.525; 6 -3.25,1.525; 7 -2.75,1.525; 8 -2.25,1.525; 9 -1.75,1.525; 10 -1.25,1.525; 11 -0.75,1.525; 12 -0.25,1.525; 13 0.25,1.525; 14 0.75,1.525; 15 1.25,1.525; 16 1.75,1.525; 17 2.25,1.525; 18 2.75,1.525; 19 3.25,1.525; 20 3.75,1.525; 21 4.25,1.525; 22 4.75,1.525; 23 5.25,1.525; 24 5.75,1.525 | smd 0.3 x 1: MP1 -6.54,-1.125; MP2 6.54,-1.125
SAMACSYS_PARTS_USB4110GFA = smd 0.3 x 1.15: A1 -3.35,3.678; A4 -2.55,3.678; A5 -1.25,3.678; A6 -0.25,3.678; A7 0.25,3.678; A8 1.25,3.678; A9 2.55,3.678; A12 3.35,3.678; B1 3.05,3.678; B4 2.25,3.678; B5 1.75,3.678; B6 0.75,3.678; B7 -0.75,3.678; B8 -1.75,3.678; B9 -2.25,3.678; B12 -3.05,3.678 | smd 2.18 x 2: MP1 -5.11,-0.827; MP2 5.11,-0.827; MP3 -5.11,3.103; MP4 5.11,3.103 | hole 0.65: -2.89,2.603; 2.89,2.603
JST04_1MM_RA = smd 0.6 x 1.35: 1 -1.5,0; 2 -0.5,0; 3 0.5,0; 4 1.5,0 | smd 1.2 x 2: NC1 2.8,-3.675; NC2 -2.8,-3.675
112ATAARR03ATTEND = smd 1.8 x 1.2: G1 10.6,10.4; G2 4.9,10.4; S1 7.75,10.4; S2 2.05,10.4 | smd 1.4 x 1.9: G3 13.6,-3.85; G4 0.45,-2.85 | smd 0.7 x 1.5: P1 8.8,0; P2 7.7,0.4; P3 6.6,0; P4 5.5,-0.2; P5 4.4,0; P6 3.3,-0.2; P7 2.2,0; P8 1.1,0
IND_4828-WE-TPC_WRE = smd 0.9 x 5.3: 1 -2.286,0; 2 2.286,0
ESP32_WROVER_SPARKFUN-IC-POWER_SOT23-5 = smd 0.55 x 1.2: 1 -0.95,-1.3; 2 0,-1.3; 3 0.95,-1.3; 4 0.95,1.3; 5 -0.95,1.3
ESP32C6_VARISTOR_CT/CN1812 = smd 1.5 x 3.6: 1 -2.25,0; 2 2.25,0
ESP32_WROVER_SPARKFUN-DISCRETESEMI_SOT23-3 = smd 0.8 x 0.9: 1 -0.95,-1; 2 0.95,-1; 3 0,1.1
SOT65P210X110-3N = smd 1.05 x 0.5: 1 -1.05,0.65; 2 -1.05,-0.65; 3 1.05,0
ESP32_WROVER_EAGLE-LTSPICE_R0402 = smd 0.7 x 0.9: 1 -0.65,0; 2 0.65,0
ESP32_WROVER_BME680_PSON80P300X300X100-8N = smd 1.016 x 0.5: 1 1.458,1.2; 2 1.458,0.4; 3 1.458,-0.4; 4 1.458,-1.2; 5 -1.458,-1.22; 6 -1.458,-0.4; 7 -1.458,0.4; 8 -1.458,1.2
SJ = smd 1.168 x 1.6: 1 -0.762,0; 2 0.762,0
TP20R = smd 2 x 2: TP 0,0
SON127P600X800X80-9N = smd 0.94 x 0.44: 1 -3.895,1.905; 2 -3.895,0.635; 3 -3.895,-0.635; 4 -3.895,-1.905; 5 3.895,-1.905; 6 3.895,-0.635; 7 3.895,0.635; 8 3.895,1.905 | smd 3.4 x 4.3: 9 0,0
XCVR_ESP32-C6-WROOM-1-N8 = smd 1.5 x 0.9: 1 -8.75,5.26; 2 -8.75,3.99; 3 -8.75,2.72; 4 -8.75,1.45; 5 -8.75,0.18; 6 -8.75,-1.09; 7 -8.75,-2.36; 8 -8.75,-3.63; 9 -8.75,-4.9; 10 -8.75,-6.17; 11 -8.75,-7.44; 12 -8.75,-8.71; 13 -8.75,-9.98; 14 -8.75,-11.25; 15 8.75,-11.25; 16 8.75,-9.98; 17 8.75,-8.71; 18 8.75,-7.44; 19 8.75,-6.17; 20 8.75,-4.9; 21 8.75,-3.63; 22 8.75,-2.36; 23 8.75,-1.09; 24 8.75,0.18; 25 8.75,1.45; 26 8.75,2.72; 27 8.75,3.99; 28 8.75,5.26 | smd 0.8 x 0.8: 29_1 -2.755,0.79; 29_2 -1.505,0.79; 29_3 -0.255,0.79; 29_4 -2.755,-0.46; 29_5 -1.505,-0.46; 29_6 -0.255,-0.46; 29_7 -2.755,-1.71; 29_8 -1.505,-1.71; 29_9 -0.255,-1.71
SOIC127P1032X265-16N = smd 2.05 x 0.59: 1 -4.655,4.445; 2 -4.655,3.175; 3 -4.655,1.905; 4 -4.655,0.635; 5 -4.655,-0.635; 6 -4.655,-1.905; 7 -4.655,-3.175; 8 -4.655,-4.445; 9 4.655,-4.445; 10 4.655,-3.175; 11 4.655,-1.905; 12 4.655,-0.635; 13 4.655,0.635; 14 4.655,1.905; 15 4.655,3.175; 16 4.655,4.445
SON50P200X200X80-9N = smd 0.76 x 0.27: 1 -0.985,0.75; 2 -0.985,0.25; 3 -0.985,-0.25; 4 -0.985,-0.75; 5 0.985,-0.75; 6 0.985,-0.25; 7 0.985,0.25; 8 0.985,0.75 | smd 0.9 x 1.3: 9 0,0

### Placement (x,y rotation side)
BOOT_BUTTON  64,108.55 180 top
C1  159.9,6.3 270 top
C1_BAT  123,51 180 top
C1_BAT1  124.3,38.55 0 top
C1_BAT2  135.92,41.16 270 top
C2  158.5,6.3 270 top
C2_BAT  134.85,52.8 270 top
C3  132.6,40.3 270 top
C4  94.5,30.9 90 top
C4_USB  155.7,45.9 180 top
C5  2.2,18.1 0 top
C5_USB  155.7,47.2 180 top
C6  67.7,108.2 270 top
C7  81.5,24.8 0 top
C8  87.7,48.2 0 top
C9  6.7,100.6 90 top
C10  27.7,108.2 270 top
C10_SUPERCAP  94.4,51.6 270 top
C11  45.3,108.1 270 top
C_DELAY  6.58,18.29 180 top
CHANGE_BUTTON1  24,108.55 180 top
CHANGE_BUTTON2  49,108.55 180 top
CHG_LED  126.93,51.08 90 top
D1  155,49.8 0 top
D2  123.6,41.5 90 top
D3  91,26.78 0 top
D4  91,30.28 180 top
D5  81.9,33.8 180 top
D6  75.8,22.6 0 top
D7  88.5,64 0 top
D8  11.8,98.7 0 top
D9  32.7,49.4 270 top
D10  43.3,38.5 90 top
D11  48.1,38.5 90 top
D12  46.4,38.5 90 top
EPD_C1  72.8,19.1 90 top
EPD_C2  74.05,19.1 90 top
EPD_C5  94.1,21.4 90 top
EPD_C6  92.05,21.4 90 top
EPD_C7  89.8,21.4 90 top
EPD_C8  87.8,21.4 90 top
EPD_C9  85.65,21.4 90 top
EPD_C10  83.5,21.4 90 top
EPD_C11  81.5,21.4 90 top
EPD_C12  79.65,21.4 90 top
IC1  6.5,22.3 270 top
IC4  127.8,41.4 0 top
J1  87.1,16.6 0 top
J2  167.9,54.3 90 top
J3  165.35,19.3 90 top
J4  5.08,95.9 270 top
L1  81.9,29.2 270 top
MCP73831  130.7,50.4 90 top
PFMF.050.1  154.2,43.2 180 top
Q1  136.89,47.81 0 top
Q2  78.3,25.7 270 top
Q3  69.7,17.6 90 top
R1_BAT  126.9,49.7 180 top
R1_PINH  157.1,6.3 90 top
R1_PINH1  88.5,62.4 0 top
R1_PWRUSB  121.9,41.6 90 top
R2  70.6,13.1 270 top
R2-PINH  155.7,6.3 90 top
R2-PINH1  92.3,61.2 90 top
R2-USB  150.6,50 270 top
R2-USB1  157.83,52 90 top
R2_BAT  129.4,46.8 90 top
R3  68.4,14.1 180 top
R4  73,16.2 180 top
R5  31.1,49.4 270 top
R6  43.6,35 270 top
R7  47.8,35 270 top
R8  46.4,35 270 top
R9  73.4,25.9 90 top
R10  8.7,100.6 90 top
R_BOOT  60.5,108.2 90 top
R_CAPACITOR  92.1,51.3 90 top
R_CHANGE  20.5,108.2 90 top
R_CHANGE1  52.7,108.1 90 top
R_CL1  75.6,25.78 90 top
R_RESET  2.1,26.1 180 top
RESET_BUTTON  2.1,22.6 270 top
SENSOR2  158.05,11.6 90 top
SJ1  67.1,12.2 0 top
TP1  75.8,102.7 0 top
TP2  82.8,102.7 0 top
TP3  150.1,61.5 0 top
TP4  89.8,102.7 0 top
TP5  150.1,64.72 180 top
TP6  6.7,70 0 top
TP7  16.2,37.6 0 top
TP8  41.2,30 0 top
TP9  13.1,71.5 0 top
TP10  20.2,37.5 0 top
TP11  10.7,37.5 0 top
TP12  21,71 0 top
TP13  29.2,71.8 0 top
TP14  117.1,42.4 0 top
TP15  41.5,64.4 0 top
TP16  46.7,30 0 top
TP17  99.8,22.3 0 top
U1  36.3,55.6 0 top
U2  13.1,55.6 90 top
U3  85.1,55.6 270 top
U4  139.93,52.68 0 top

### Tracks (layer width: path | path; a pad name or v marks a point on that pad's centre or on a via)
3V3
  Top 0.3: 31.1,42.7 R5.2 31.05,48.7 29.3,48.7 28.8,49.2 28.8,53.6 30.16,54.97 U1.3 32.86,54.97 34.32,56.42 34.32,57.87 34.56,58.1 39.49,58.1 40.19,57.4 | 31.1,42.7 28.6,40.2 15.3,40.2 | U1.7 40.19,57.4 | 40.19,57.4 U1.8 42.5,57.51 | J4.P4 7,90.4 7.7,91.1 7.7,96.9 6.7,97.9 C9.1 7,99.95 8.3,101.25 R10.2 15,107.55 R_CHANGE.1 20.5,106.45 24.45,102.5 31.2,102.5 | 31.2,102.5 44.4,89.3 44.4,59.4 42.5,57.51 | R1_PINH1.2 89.55,62.8 D7.2 89.55,64.85 88.9,65.5 54,65.5 46,57.5 42.51,57.5 42.5,57.51 | U3.2 88.27,60.77 89.15,61.65 R1_PINH1.2 | R1_PINH1.2 91.75,62.4 R2-PINH1.2 94.1,61.85 120.15,35.8 126.7,35.8 127.9,37 127.9,41.9 128.35,42.35 IC4.5 129.65,42.35 130.3,41.7 132.5,41.7 C3.+ C1_BAT2.1 136.99,41.81 160,18.8 J3.2 | Q2.3 76.87,25.7 76.3,25.13 R_CL1.1 75.12,25.13 73.7,26.55 R9.2 53.45,26.55 47.8,32.2 R7.2 R8.2 | R8.2 R6.2 39.45,34.35 31.1,42.7 | R8.2 46.4,30.3 TP16.TP | 31.2,102.5 49.7,102.5 52.7,105.5 R_CHANGE1.1 60.4,107.45 R_BOOT.1 | R_RESET.1 5.8,26.1 | 5.8,26.1 6.5,25.4 IC1.2 | 15.3,40.2 13.5,38.4 13.5,31.9 7.7,26.1 5.8,26.1 | 15.3,40.2 11.56,40.2 9.11,42.65 U2.2
32KHZ  (via drill 0.35)
  Top 0.152: R2-PINH1.1 92.25,60.6 90.7,60.6 90.35,60.26 U3.1 89.54,58.66 88.18,57.3 v47,57.3 | U2.9 18,50.4 27.2,59.6 43,59.6 v43.1,59.5
  Bottom 0.152: v43.1,59.5 45.3,57.3 v47,57.3
DN  (via drill 0.35)
  Top 0.152: J2.B7 163.45,53.55 163.3,53.7 163.3,54.4 | J2.A7 163.45,54.55 163.3,54.4 | 163.3,54.4 162.5,53.6 v160.5,53.6 | v157.9,48.9 157.85,48.85 D1.4
  Bottom 0.152: v160.5,53.6 159.5,53.6 158.8,52.9 158.8,49.8 v157.9,48.9
DP  (via drill 0.35)
  Top 0.152: J2.A6 164.95,54.05 165.1,54.2 165.1,54.9 164.95,55.05 J2.B6 162.45,55.05 161.6,54.2 v160,54.2 | v156.2,53.4 156.2,50.8 D1.6
  Bottom 0.152: v156.2,53.4 157,54.2 v160,54.2
EPD_3V3  (via drill 0.35)
  Top 0.3: Q2.2 77.35,24.8 C7.1 | C7.1 80.85,25.45 81.9,26.5 L1.2 | C7.1 80.85,24.25 v81.7,23.4 | v95.6,23 95.6,21.3 | 95.6,21.3 95.05,20.75 EPD_C5.1 94.1,19.4 93.55,18.85 86.18,18.85 85.85,18.52 J1.10 J1.9 | 95.6,21.3 96.6,22.3 TP17.TP
  Bottom 0.3: v95.6,23 95.2,23.4 v81.7,23.4
EPD_3V3_C  (via drill 0.35)
  Top 0.152: 28.6,68.03 28.6,71.1 29.1,71.6 TP13.TP
  Top 0.3: U2.18 20.54,65.94 22.63,68.03 28.6,68.03 32.87,68.03 v37.1,63.8 | v74.2,29.6 75.6,28.2 R_CL1.2 77.08,26.43 Q2.1
  Bottom 0.3: v37.1,63.8 71.3,29.6 v74.2,29.6
EPD_BUSY  (via drill 0.35)
  Top 0.152: v12.5,67.6 12.3,67.8 10.6,67.8 | 10.6,67.8 10.38,67.58 U2.26 | 13.1,71.35 TP9.TP 13.1,70.3 10.6,67.8 | J1.16 88.85,14.54 85.91,11.6 v84.25,11.6
  Bottom 0.152: v12.5,67.6 12.5,64.8 19.12,58.18 19.12,48.58 24.4,43.3 24.85,42.85 49.6,42.85 68.1,24.35 68.1,15.6 72.1,11.6 v84.25,11.6
EPD_CS  (via drill 0.35)
  Top 0.152: v72.2,25.1 73.25,25.1 R9.1 73.4,24.5 74.1,23.8 74.8,23.8 75.05,23.55 D6.1 75.05,21.99 v76.87,20.17 | U2.11 20.54,41.56 v21.2,40.9 | v63.9,27.2 v68,27.2 | v77.2,17.9 77.2,15.09 78.82,13.48 86.47,13.48 87.35,14.36 J1.13 | v21.95,38.8 21.5,38.8 TP10.TP
  Bottom 0.152: v72.2,25.1 71.2,25.1 69.1,27.2 v68,27.2 | v21.2,40.9 23.3,38.8 | 23.3,38.8 34.4,27.7 63.4,27.7 v63.9,27.2 | v77.2,17.9 77.2,19.84 v76.87,20.17 | v21.95,38.8 23.3,38.8
EPD_DC  (via drill 0.35)
  Top 0.152: v26.9,44.1 25.3,44.1 24.6,43.4 v21.1,43.4 | U2.5 13.1,46.67 13.1,45.1 | 13.1,45.1 v13.1,44.3 | v76.6,16.9 76.6,15.3 78.72,13.18 86.57,13.18 87.65,14.26 87.65,16.49 87.85,16.69 J1.14 | v10.85,39.1 10.85,37.6 TP11.TP | 13.1,45.1 12.4,44.4 12.4,44 13.05,43.35 v13.05,41.45
  Bottom 0.152: v21.1,43.4 14,43.4 v13.1,44.3 | v26.9,44.1 49.4,44.1 v76.6,16.9 | v13.05,41.45 10.85,39.26 v10.85,39.1
EPD_RST  (via drill 0.35)
  Top 0.152: v16.8,68.6 16.8,65.1 16.7,65 16.7,64.38 U2.21 | v19.1,70.1 20.1,70.1 TP12.TP | J1.15 88.35,16.55 v88.1,16.3
  Bottom 0.152: v16.8,68.6 16.8,69 17,69.2 | 17,69.2 18.2,69.2 19.4,68 19.4,48.9 19.95,48.35 50.85,48.35 70.1,29.1 73.7,29.1 86.5,16.3 v88.1,16.3 | 17,69.2 17.9,70.1 v19.1,70.1
FLASH_CS  (via drill 0.35)
  Top 0.152: D9.1 32.6,50.05 R5.1 v31.1,53.8 | v31.1,56.9 31.7,57.51 | 31.7,57.51 U1.1 | U2.12 21.81,48.51 26.7,53.4 26.7,55.4 28.8,57.51 31.7,57.51
  Bottom 0.152: v31.1,53.8 v31.1,56.9
GDR  (via drill 0.35)
  Top 0.152: Q3.1 69.05,15.45 v69.3,15.2 | R4.1 73.67,16.23 73.67,15.43 | J1.23 92.35,13.96 88.94,10.55 78.55,10.55 73.67,15.43 | v73,15.2 73.5,15.2 73.67,15.38 73.67,15.43
  Bottom 0.152: v69.3,15.2 v73,15.2
GND  (via drill 0.35)
  Top 0.152: 76.6,22.6 D6.2 v76.55,21.55 | 71.7,11 71.3,10.6 66.79,10.6 66.34,11.05 SJ1.1 66.34,13.1 57.64,21.8 28.9,21.8 26.8,23.9 26.8,35.7 v29.2,38.1 | 71.7,11 71.7,13.3 | 71.7,13.3 71.25,13.75 R2.1 | 71.7,13.3 72.35,13.95 R4.2 | v87.8,31.7 87.8,29.1 89.25,27.65 D3.1 86.38,26.78 85.5,25.9 82.5,25.9 82.2,25.6 82.2,24.85 C7.2 | v75.1,20 74.85,19.75 EPD_C2.2 EPD_C1.2 72.2,19.75 v71.85,19.4 | 76.5,22.5 76.6,22.6 | C2.2 C1.2 160.65,5.65 | 160.65,5.65 161,6 | 161,6 161,8.42 SENSOR2.5 | SENSOR2.7 157.65,8.75 | v158,8.4 157.65,8.75 | v162,7 161,6 | 160.65,5.65 163.35,5.65 165.35,7.65 J3.1 166.5,17.8 166.8,18.1 166.8,42.5 164.79,44.51 | 157.65,8.75 157.2,9.2 156,9.2 155.8,9.4 155.8,12.6 156.26,13.06 SENSOR2.1 156.9,13.1 156.9,14.9 v157.7,15.7 | 164.79,44.51 J2.MP3 | J2.MP3 J2.MP1 | J2.MP3 164.8,50.37 J2.A1 J2.B12 157.93,51.25 R2-USB1.1 157.45,51.35 156.9,51.9 156.9,53.9 156.7,54.1 155.6,54.1 155.2,53.7 155.2,49.7 155.05,49.55 | 164.79,44.51 158.39,38.1 v158.3,38.1 | J2.MP4 164.79,62.91 162.98,64.72 TP5.TP | J2.MP4 J2.MP2 | J2.B1 J2.A12 164.22,58.84 J2.MP4 | C4_USB.2 C5_USB.2 155.05,49.55 | 155.05,49.55 154.8,49.8 D1.2 151.9,49.8 151.45,49.35 R2-USB.2 150.45,49.2 149.8,49.2 149.6,49.4 v149.6,52.1 | J2.MP4 157.41,59.41 154.3,56.3 v151.1,56.3 | C1_BAT2.2 136,40.43 136,39.2 135.6,38.8 C3.- 131.1,37.3 v129,37.3 | R1_PWRUSB.1 121.9,38.5 123.1,37.3 124.6,37.3 125,37.7 | 125,38.5 125,37.7 | 125,38.5 C1_BAT1.2 | IC4.2 127.1,41.4 127.3,41.2 | 127.3,41.2 127.3,38.7 127.1,38.5 125,38.5 | R2_BAT.1 129.39,44.3 127.3,42.2 127.3,41.2 | 125,37.7 125.4,37.3 v126.7,37.3 | v142.5,52.2 142.27,52.43 U4.6 140.18,52.43 U4.9
  Top 0.152: U4.4 139.73,51.93 139.93,52.13 U4.9 | U4.1 139.67,53.43 139.93,53.17 U4.9 | C2_BAT.2 135.85,52.15 v137.4,50.6 | MCP73831.2 132.8,50.4 v133.4,49.8 | R2_BAT.1 129.34,46.2 125.2,46.2 v124.5,46.9 | v122.3,48.9 122.3,50.95 C1_BAT.2 122.35,51.95 121.6,52.7 v117,52.7 | R2_BAT.1 v131.6,46.15 | C10_SUPERCAP.1 96.8,52.7 | 96.8,52.7 v98.1,52.7 | U3.13 85.73,49.3 | 85.73,49.3 85.73,45.2 | 85.73,45.2 85.73,43.97 v87,42.7 | C8.2 88.35,48.75 v88,49.1 | v86.4,49.1 85.93,49.1 85.73,49.3 | 85.73,45.2 86.43,44.5 96,44.5 98,46.5 98,51.5 96.8,52.7 | RESET_BUTTON.1 2.84,20.54 2.85,20.55 RESET_BUTTON.2 | C10.2 26,107.55 CHANGE_BUTTON1.2 | CHANGE_BUTTON1.2 CHANGE_BUTTON1.1 22.23,107.85 | BOOT_BUTTON.1 BOOT_BUTTON.2 | BOOT_BUTTON.2 67.45,107.8 C6.2 85.85,107.55 89.8,103.6 TP4.TP | CHANGE_BUTTON1.2 25.75,105.35 v25.6,105.2 | v15.2,98.7 13.7,98.7 | 13.7,98.7 D8.2 | BOOT_BUTTON.2 64.64,107.8 | D12.2 46.5,39.25 | 46.5,39.25 D11.2 | 7.8,46.81 U2.1 7.84,54.13 | 12.4,55.34 U2.29_3 | 12.4,55.34 U2.29_6 | U2.29_6 U2.29_9 U2.29_8 14.7,54.09 | 14.7,54.09 U2.29_5 | U2.29_5 U2.29_2 | U2.29_2 12.31,55.26 12.4,55.34 | U2.29_5 U2.29_6 | U2.29_2 U2.29_1 U2.29_4 U2.29_7 14.7,52.95 14.7,54.09 | D10.2 43.3,41 v43.8,41.5 | v46,41.5 46.5,41 46.5,39.25 | 37.1,39.4 32.7,43.8 D9.2 36.3,52.25 U1.9 34.39,53.7 U1.4 | 37.1,39.4 v38.9,39.4 | 37.1,39.4 v35.7,39.4 | 7.84,54.13 U2.28 7.84,65.76 1.23,72.37 J4.G3 1.28,82.35 1.28,94.51 2.19,95.41 J4.G4 2.26,95.48 2.26,96.6 5.3,99.64 | J4.G1 15.53,85.36 15.53,86.4 16.3,87.17 16.3,90.18 15.53,90.94 J4.G2 15.46,91.01 15.46,92.06 14.62,92.9 14.62,97.78 13.7,98.7 | 7.84,54.13 12.25,54.13 U2.29_2 | J4.P6 4.91,92.62 5.4,92.62 6.03,93.25 6.03,96.47 5.3,97.2 5.3,99.64
  Top 0.152: 6.73,101.28 C9.2 6.11,101.25 5.3,100.44 5.3,99.64 | 87.75,22.1 EPD_C8.2 | EPD_C8.2 EPD_C9.2 EPD_C10.2 84.7,23.25 v84.7,24 | EPD_C8.2 EPD_C7.2 EPD_C6.2 EPD_C5.2 | 76.6,22.6 78.2,22.6 78.75,22.05 EPD_C12.2 EPD_C11.2 82.15,22.7 C7.2 | v83.49,24.8 C7.2 | v73.62,12.92 71.7,11 | 45.2,107.55 C11.2 46.9,107.45 CHANGE_BUTTON2.1 CHANGE_BUTTON2.2 | C_DELAY.2 5.74,18.1 C5.2
  Bottom 0.152: v158,8.4 158.4,8 161.8,8 162,7.8 v162,7 | v157.7,15.7 157.7,37.5 v158.3,38.1 | 149.6,54.8 v151.1,56.3 | 149.6,54.8 v149.6,52.1 | v126.7,37.3 v129,37.3 | v142.5,52.2 143.2,52.2 | 143.2,52.2 147,52.2 149.6,54.8 | 143.2,52.2 141.6,50.6 v137.4,50.6 136.05,50.6 135.25,49.8 | v133.4,49.8 135.25,49.8 | v124.5,46.9 124.3,46.9 v122.3,48.9 | v131.6,46.15 135.25,49.8 | v98.1,52.7 v117,52.7 | v87,42.7 87.8,41.9 v87.8,31.7 | v88,49.1 v86.4,49.1 | v25.6,105.2 19.1,98.7 v15.2,98.7 | v43.8,41.5 45.3,41.5 | 45.3,41.5 v46,41.5 | v38.9,39.4 43.2,39.4 45.3,41.5 | v35.7,39.4 30.5,39.4 v29.2,38.1 | v76.55,21.55 76.55,21.45 v75.1,20 | v84.7,24 84.7,24.5 84.39,24.81 v83.5,24.81 | v71.85,19.4 71.85,17.05 72.6,16.3 74.3,16.3 75.2,15.4 75.2,14.5 v73.62,12.92
  other vias: 22.9,53.4 30.9,64.4 37.9,69.4 39.9,83.4 32.9,78.4 74.9,71.4 53.9,87.4 12.9,16.4 38.9,16.4 0.9,45.4 1.9,45.4 2.9,45.4 3.9,45.4 4.9,45.4 5.9,45.4 6.9,45.4 7.9,48.4 7.9,49.4 7.9,50.4 7.9,51.4 7.9,52.4 7.9,53.4 7.9,54.4 7.9,55.4 7.9,56.4 7.9,57.4 7.9,58.4 7.9,59.4 7.9,60.4 7.9,61.4 7.9,62.4 5.9,65.4 4.9,65.4 3.9,65.4 2.9,65.4 1.9,65.4 0.9,65.4 6.9,65.4 65.62,22.92 102.62,2.92 128.62,17.92 165.62,2.92 88.62,107.92 17.62,40.92 11.62,44.92 17.62,42.92 22.62,41.92 26.62,41.92 27.2,46.1 10.62,42.92 3.9,17.4 3.9,22.4
  pour Top: 6.56,46.56 6.54,46.54 6.52,46.52 0.08,46.52 0.08,0.08 75.92,0.08 75.92,10.02 75.94,10.04 75.96,10.06 75.98,10.08 98.22,10.08 98.24,10.06 98.26,10.04 98.28,10.02 98.28,0.08 170.12,0.08 170.12,67.12 92.18,67.12 92.16,67.14 92.14,67.16 92.12,67.18 92.12,111.12 68.48,111.12 68.48,110.08 68.46,110.06 68.44,110.04 68.42,110.02 19.78,110.02 19.76,110.04 19.74,110.06 19.72,110.08 19.72,111.12 0.08,111.12 0.08,64.68 6.52,64.68 6.54,64.66 6.56,64.64 6.58,64.62 6.58,46.58
  pour Bottom: 6.56,46.56 6.54,46.54 6.52,46.52 0.08,46.52 0.08,0.08 75.92,0.08 75.92,10.02 75.94,10.04 75.96,10.06 75.98,10.08 98.22,10.08 98.24,10.06 98.26,10.04 98.28,10.02 98.28,0.08 170.12,0.08 170.12,67.12 92.18,67.12 92.16,67.14 92.14,67.16 92.12,67.18 92.12,111.12 68.48,111.12 68.48,110.08 68.46,110.06 68.44,110.04 68.42,110.02 19.78,110.02 19.76,110.04 19.74,110.06 19.72,110.08 19.72,111.12 0.08,111.12 0.08,64.68 6.52,64.68 6.54,64.66 6.56,64.64 6.58,64.62 6.58,46.58
I2C_PW  (via drill 0.35)
  Top 0.152: R2-PINH.2 R1_PINH.2 C2.1 C1.1 159.9,7.6 158.45,9.05 SENSOR2.6 158.45,11.45 157.65,12.25 | 157.65,12.25 SENSOR2.2 157.75,13.16 157.75,14.65 v157.7,14.7 | SENSOR2.8 156.85,11.45 157.65,12.25 | U2.17 21.81,66.11 22.6,66.9 v23.3,66.9
  Bottom 0.152: v157.7,14.7 149.8,22.6 108.6,22.6 87.1,44.1 57.7,44.1 33.4,68.4 27.2,68.4 25.7,66.9 v23.3,66.9
INT_RTC  (via drill 0.35)
  Top 0.152: R1_PINH1.1 87,61.55 U3.3 87,59.2 86,58.2 v48.5,58.2 | U2.8 16.73,49.53 27.3,60.1 42.4,60.1 v43,60.7 42.85,60.85 42.85,63.1 41.6,64.35 TP15.TP
  Bottom 0.152: v43,60.7 43.5,60.7 46,58.2 v48.5,58.2
IO/BOOT  (via drill 0.35)
  Top 0.152: C6.1 67.25,109.3 BOOT_BUTTON.3 BOOT_BUTTON.4 61.8,108.85 R_BOOT.2 57.85,108.85 v57.6,108.6 | v24.2,67.5 24.2,64.5 U2.15
  Bottom 0.152: v57.6,108.6 57.6,107.2 24.2,73.8 v24.2,67.5
IO/CHANGE1  (via drill 0.35)
  Top 0.152: C10.1 27.25,109.3 CHANGE_BUTTON1.3 CHANGE_BUTTON1.4 21.8,108.85 R_CHANGE.2 v19.45,108.85 | v14.69,66.5 14.19,66 U2.23
  Bottom 0.152: v14.69,66.5 14.69,104.09 v19.45,108.85
IO/CHANGE2  (via drill 0.35)
  Top 0.152: R_CHANGE1.2 52.15,109.3 CHANGE_BUTTON2.3 CHANGE_BUTTON2.4 45.85,109.3 C11.1 41.95,108.75 37.2,104 30.6,104 v30.2,103.6 | U2.10 19.27,49.33 v18.6,50 | v18.5,59.7 v18.5,52.2
  Bottom 0.152: v30.2,103.6 30.2,85.5 15.9,71.2 15.9,62.3 v18.5,59.7 | v18.5,52.2 18.5,50.1 v18.6,50
MISO  (via drill 0.35)
  Top 0.152: R8.1 D12.1 45.25,37.75 44.7,38.3 44.7,48.3 44,49 v42.9,49 | U1.2 28.53,56.23 v28,55.7 | v26.7,60.5 26.4,60.8 9.8,60.8 9.11,61.49 U2.27 9.1,64.4 9.1,64.96 6.7,67.36 | 3.58,73.1 3.58,70.48 6.7,67.36 | 3.58,73.1 3.58,92.76 4.49,93.67 5.05,93.67 J4.P7 | 3.6,73.1 3.58,73.1 | 6.7,67.36 TP6.TP
  Bottom 0.152: v42.9,49 31.3,49 27.3,53 27.3,55 | v26.7,60.5 27.3,59.9 27.3,55 | 27.3,55 v28,55.7
MOSI  (via drill 0.35)
  Top 0.152: v66.4,25.4 66.9,24.9 71.5,24.9 78.1,18.3 78.1,14.99 79.02,14.07 86.07,14.07 86.35,14.35 J1.11 | v49.5,35.7 47.85,35.7 R7.1 47.8,36.7 48.1,37 D11.1 49.05,37.75 49.3,38 49.3,40.1 45.4,44 45.4,51.3 v43.9,52.8 | U1.5 40.75,53.7 v41.65,52.8 | U2.7 15.46,45.04 15.9,44.6 v16.4,44.6 | J4.P3 7.6,89.3 10.9,86 v10.9,70.3 | v24.35,39.6 18.35,39.6 16.35,37.6 TP7.TP
  Bottom 0.152: v66.4,25.4 56.1,35.7 53.2,35.7 | 53.2,35.7 v49.5,35.7 | v41.65,52.8 v43.9,52.8 | v16.4,44.6 18.2,44.6 | 18.2,44.6 21.1,44.6 25.35,40.35 | 25.35,40.35 28.8,36.9 52,36.9 53.2,35.7 | 18.2,44.6 17.5,43.9 16,43.9 11.07,48.83 11.07,68.49 10.9,68.66 v10.9,70.3 | v24.35,39.6 25.1,40.35 25.35,40.35
N$1  (via drill 0.35)
  Top 0.152: J2.B5 162.85,56.05 161.6,54.8 v160.5,54.8 | v150.6,52.1 R2-USB.1
  Bottom 0.152: v150.6,52.1 153.3,54.8 v160.5,54.8
N$2
  Top 0.152: C_DELAY.1 7.23,19.33 7.5,19.6 7.5,20.85 IC1.5
N$3  (via drill 0.35)
  Top 0.152: C1_BAT1.1 123.6,38.6 D2.1 | IC4.3 D2.1 | D2.1 123.6,41 124.95,42.35 IC4.1 126.4,43.5 v127.2,44.3 | v137.9,45.7 137.84,45.76 Q1.2
  Bottom 0.152: v127.2,44.3 136.5,44.3 v137.9,45.7
N$4  (via drill 0.35)
  Top 0.152: v159.6,52.6 157.88,52.6 R2-USB1.2 | v161.3,53 164.17,53 J2.A5
  Bottom 0.152: v159.6,52.6 160,53 v161.3,53
N$7  (via drill 0.35)
  Top 0.152: R_CAPACITOR.2 92.1,58.7 v91.6,59.2 | v85.6,62.8 85.6,63.7 85.9,64 D7.1
  Bottom 0.152: v91.6,59.2 88.8,62 86.4,62 v85.6,62.8
N$8  (via drill 0.35)
  Top 0.152: v71.5,14.4 71.35,14.55 71.35,16.65 72.8,18.1 EPD_C1.1 | v89.25,13.5 89.45,13.7 90.7,13.7 91.35,14.35 J1.21
  Bottom 0.152: v89.25,13.5 87.85,12.1 73.8,12.1 v71.5,14.4
N$9  (via drill 0.35)
  Top 0.152: v75.7,18.6 74.1,18.6 EPD_C2.1 | J1.20 90.85,16.56 v90.59,16.3
  Bottom 0.152: v75.7,18.6 77.5,16.8 82.6,16.8 83.6,15.8 90.09,15.8 v90.59,16.3
N$10
  Top 0.152: C4.1 92.78,30.25 D4.1 D3.2
N$13
  Top 0.152: MCP73831.5 R2_BAT.2
N$14  (via drill 0.35)
  Top 0.152: MCP73831.1 132,48.2 v131.8,48 | v128.2,48 127.55,48.65 R1_BAT.1
  Bottom 0.152: v131.8,48 v128.2,48
N$15
  Top 0.152: CHG_LED.C 126.25,51.01 R1_BAT.2
N$31
  Top 0.152: EPD_C6.1 92.05,19.85 91.4,19.2 84.94,19.2 84.35,18.61 J1.7
N$33
  Top 0.152: EPD_C7.1 89.8,20.15 89.13,19.48 84.72,19.48 83.85,18.61 J1.6
N$34
  Top 0.152: EPD_C8.1 87.8,20.15 87.41,19.76 84.6,19.76 83.35,18.51 J1.5
N$36
  Top 0.152: J1.3 82.35,19.35 82.7,19.7 83.1,19.7 83.5,20.11 EPD_C10.1
N$37
  Top 0.152: EPD_C12.1 79.7,20.7 79.7,19.7 80.2,19.2 81.1,19.2 81.35,18.95 J1.1
PREVGH  (via drill 0.35)
  Top 0.152: D5.1 85,33.8 85.5,33.3 v85.5,32.4 | v86.7,21.2 86.25,20.75 EPD_C9.1 85.65,20.35 85.34,20.04 84.38,20.04 82.85,18.51 J1.4 | v86.7,22.6 v86.7,23.93
  Bottom 0.152: v86.7,21.2 v86.7,22.6 | v85.5,32.4 85.5,28.9 86.7,27.7 v86.7,23.93
PREVGL
  Top 0.152: D4.2 89.25,29.35 91.5,27.1 91.5,24.7 91.25,24.45 83.85,24.45 82.5,23.1 82.5,21 82.25,20.75 81.7,20.75 | 81.7,20.75 EPD_C11.1 81.4,20.65 | 81.7,20.75 81.5,20.55 81.5,19.2 81.85,18.84 J1.2
RESE  (via drill 0.35)
  Top 0.152: R3.1 69.1,14.1 70.35,15.35 Q3.2 70.35,17.15 71.4,18.2 v71.4,18.6 | J1.22 91.85,15.95 v91.8,15.9
  Bottom 0.152: v71.4,18.6 71.4,19.65 71.85,20.1 72.1,20.1 77.1,15.1 91,15.1 v91.8,15.9
RESE'
  Top 0.152: R2.2 68.11,12.45 SJ1.2 67.86,13.99 R3.2
RESET  (via drill 0.35)
  Top 0.152: 10.36,46.87 U2.3 10.38,44.64 v10.34,44.6 | IC1.1 8.6,23.7 9,23.3 9,17.3 7.6,15.9 2.7,15.9 1.55,17.05 C5.1 1.55,19.15 1.35,19.35 RESET_BUTTON.4 RESET_BUTTON.3 1.35,26 R_RESET.2 1.45,35.45 8.58,42.58 v8.58,42.7
  Bottom 0.152: v8.58,42.7 10.34,44.45 v10.34,44.6
RTC_RST  (via drill 0.35)
  Top 0.152: U3.4 85.73,61.66 84.4,63 v56.8,63 | U2.16 23.08,62.92 24.6,61.4 v42,61.4
  Bottom 0.152: v42,61.4 55.2,61.4 v56.8,63
RX  (via drill 0.35)
  Top 0.152: v40.19,92.69 12.94,65.45 12.94,64.4 U2.24 | v42.42,92.69 72.81,92.69 82.79,102.68 TP2.TP
  Bottom 0.152: v42.42,92.69 v40.19,92.69
SCK  (via drill 0.35)
  Top 0.152: 43.05,31.25 49.7,24.6 71.41,24.6 77.8,18.2 77.8,14.89 78.9,13.79 86.39,13.79 86.85,14.25 J1.12 | 43.05,31.25 v41.8,32.5 | U1.6 40.93,54.97 42.3,53.6 42.3,41.2 41.8,40.7 41.8,38.2 42.25,37.75 D10.1 43.6,37.45 R6.1 43.55,35.6 v42.3,35.6 | 14.3,46.74 U2.6 14.19,43.41 v14.9,42.7 | v10.29,68.87 3.86,75.3 3.86,90.8 4.49,91.43 5.05,91.43 J4.P5 | 41.35,30.1 TP8.TP 42.45,31.25 43.05,31.25
  Bottom 0.152: v41.8,32.5 41.7,32.6 41.7,35.3 | 15.69,41.91 21.39,41.91 29.4,33.9 40.3,33.9 41.7,35.3 | 41.7,35.3 42,35.6 v42.3,35.6 | v14.9,42.7 15.69,41.91 | 15.69,41.91 12.73,41.91 10.79,43.85 10.79,68.37 v10.29,68.87
SCL  (via drill 0.35)
  Top 0.152: J3.4 162.1,20.8 v161.9,20.6 | 159.2,16.9 159.2,13.11 SENSOR2.4 | 159.2,16.9 158.8,16.5 157.4,16.5 154.9,14 154.9,5.8 155.05,5.65 R2-PINH.1 | U4.7 142.77,52.93 145.1,50.6 145.1,47.6 | 145.1,47.6 145.1,35.2 160,20.3 v160.3,20.3 | v89.9,49.3 89.54,49.66 U3.16 89.54,51.55 85.4,55.7 v42.2,55.7 | v112.1,51.3 117.7,45.7 v121.5,45.7 | v143.8,48 144.7,48 145.1,47.6 | U2.20 18,68.8 18.4,69.2 v19.1,69.2 | v159.2,17.75 159.2,16.9
  Bottom 0.152: v161.9,20.6 161.6,20.3 | v160.3,20.3 161.6,20.3 | v89.9,49.3 102.7,49.3 105.5,52.1 111.3,52.1 v112.1,51.3 | v121.5,45.7 134,45.7 136.3,48 v143.8,48 | v42.2,55.7 34.5,63.4 21.1,63.4 19.9,64.6 19.9,68.4 v19.1,69.2 | 161.6,20.3 159.2,17.9 v159.2,17.75
SDA  (via drill 0.35)
  Top 0.152: v158.5,14.7 158.5,13.1 SENSOR2.3 | R1_PINH.1 157.1,4.4 156.6,3.9 154.9,3.9 154.6,4.2 154.6,14.2 158.6,18.2 v160.3,18.2 | J3.3 164.2,19.8 | 164.2,19.8 161.8,19.8 145.4,36.2 145.4,50.7 142.67,53.43 | 164.2,19.8 163.73,19.33 v163.4,19.33 | U4.8 142.67,53.43 | 142.67,53.43 141,55.1 v135.7,55.1 | v120.2,51.8 106.4,51.8 v105.8,51.2 | v90.9,48.4 89.9,48.4 88.27,50.02 U3.15 88.27,52.43 85.5,55.2 v43.8,55.2 | U2.19 19.27,67.17 20.2,68.1 v20.9,68.1
  Bottom 0.152: 162,18.2 v158.5,14.7 | v160.3,18.2 162,18.2 | v163.4,19.33 163.13,19.33 162,18.2 | v135.7,55.1 132.4,51.8 v120.2,51.8 | v105.8,51.2 103,48.4 v90.9,48.4 | v43.8,55.2 33.2,65.8 23.3,65.8 21,68.1 v20.9,68.1
SRC  (via drill 0.35)
  Top 0.152: 80.15,33.7 D5.2 | v67.5,18.7 69.6,18.7 | 69.6,18.7 69.7,18.8 | C4.2 92.35,31.55 91.6,32.3 87,32.3 86.19,31.49 L1.1 80.15,33.24 80.15,33.7 | v62.88,27.18 64.3,28.6 71.5,28.6 76.6,33.7 80.15,33.7 | Q3.3 69.66,18.72 69.6,18.7
  Bottom 0.152: v62.88,27.18 62.75,27.05 62.75,22.25 66.3,18.7 v67.5,18.7
SS_SD  (via drill 0.35)
  Top 0.152: R10.1 8.8,99.85 8.8,99.1 9.2,98.7 | 9.2,98.7 D8.1 | v11.62,52.18 11.62,46.87 U2.4 | v9.17,90.45 9.17,98.63 9.2,98.7 | J4.P2 v7.5,88.2
  Bottom 0.152: v11.62,52.18 11.62,82.07 9.17,84.52 9.17,89.6 | v9.17,90.45 9.17,89.6 | v7.5,88.2 7.77,88.2 9.17,89.6
TX  (via drill 0.35)
  Top 0.152: v39.19,92.99 11.69,65.49 11.69,64.4 U2.25 | v46.4,99.61 72.67,99.61 75.74,102.68 TP1.TP
  Bottom 0.152: v46.4,99.61 45.8,99.61 v39.19,92.99
USB_D+  (via drill 0.35)
  Top 0.152: U2.14 29.65,46.85 v29.7,46.9 | v75.6,47.8 v50.5,47.8 | v151.8,54.2 153.75,52.25 D1.1
  Bottom 0.152: v29.7,46.9 30.6,47.8 v50.5,47.8 | v75.6,47.8 113.9,47.8 125.9,59.8 150.2,59.8 151.8,58.2 v151.8,54.2
USB_D-  (via drill 0.35)
  Top 0.152: D1.3 152.35,48.85 151.5,48 148.7,48 147.4,49.3 v147.4,50.5 | v146.3,51.5 140.1,57.7 v139.4,57.7 | v75.7,47 v51.3,47 | U2.13 23.08,45.42 23.93,44.57 v24.37,44.57
  Bottom 0.152: v147.4,50.5 147.3,50.5 v146.3,51.5 | v139.4,57.7 124.5,57.7 113.8,47 v75.7,47 | v51.3,47 32.8,47 30.37,44.57 v24.37,44.57
VBAT
  Top 0.3: TP3.TP 147,58.4 137.2,58.4 134.85,56.05 C2_BAT.1 | C2_BAT.1 136.25,53.45 136.77,52.93 U4.2 U4.3 | C2_BAT.1 133.4,53.45 132,52.05 MCP73831.3 132.85,51.35 133.7,50.5 135.9,50.5 136.89,49.51 Q1.3
VBUS  (via drill 0.35)
  Top 0.152: TP14.TP 117.1,42.35 121.85,42.35 R1_PWRUSB.2
  Top 0.3: D1.5 158.3,49.8 158.8,49.3 158.8,47.7 158.3,47.2 C5_USB.1 C4_USB.1 156.45,45.8 PFMF.050.1.1 156.45,40.65 v156.4,40.6 | v138.5,45 137.75,45 Q1.1 131.89,46.81 130.7,48 130.7,50.8 130.15,51.35 MCP73831.4 127.95,51.35 CHG_LED.A 127.68,51.32 126.9,52.1 124.75,52.1 C1_BAT.1 123.6,50.95 D2.2 122.2,42.55 R1_PWRUSB.2
  Bottom 0.3: v138.5,45 143.7,45 149.3,39.4 155.2,39.4 v156.4,40.6
VRTC
  Top 0.3: C8.1 87,48.25 87,48.4 | 87,48.4 U3.14 | R_CAPACITOR.1 94.25,50.65 C10_SUPERCAP.2 94.4,47.8 92.7,46.1 87.7,46.1 87,46.8 87,48.4
VUSB
  Top 0.3: J2.B9 J2.A4 164.17,51.7 161.36,51.7 158.6,54.7 | J2.B4 J2.A9 164.17,56.8 160.7,56.8 158.6,54.7 | PFMF.050.1.2 148.8,43.2 146.3,45.7 146.3,50.6 150.43,54.73 152.02,54.73 152.05,54.7 158.6,54.7

### Text on the board
tPlace: IO15 | IO8 | IO9/BOOT | IO16/Tx | IO17/Rx | GND | EPD_BUSY | EPD_3V3_C | EPD_RST | MISO | INT_RTC | GND | VBAT | VBUS | EPD_DC | MOSI | EPD_CS | SCK | 3V3 | RESET | EPD_3V3 | QWIIC | RESE' | UpdateMate v1.2
tNames: DeskAssistant